# Altium project PCB_Project.PrjPcb
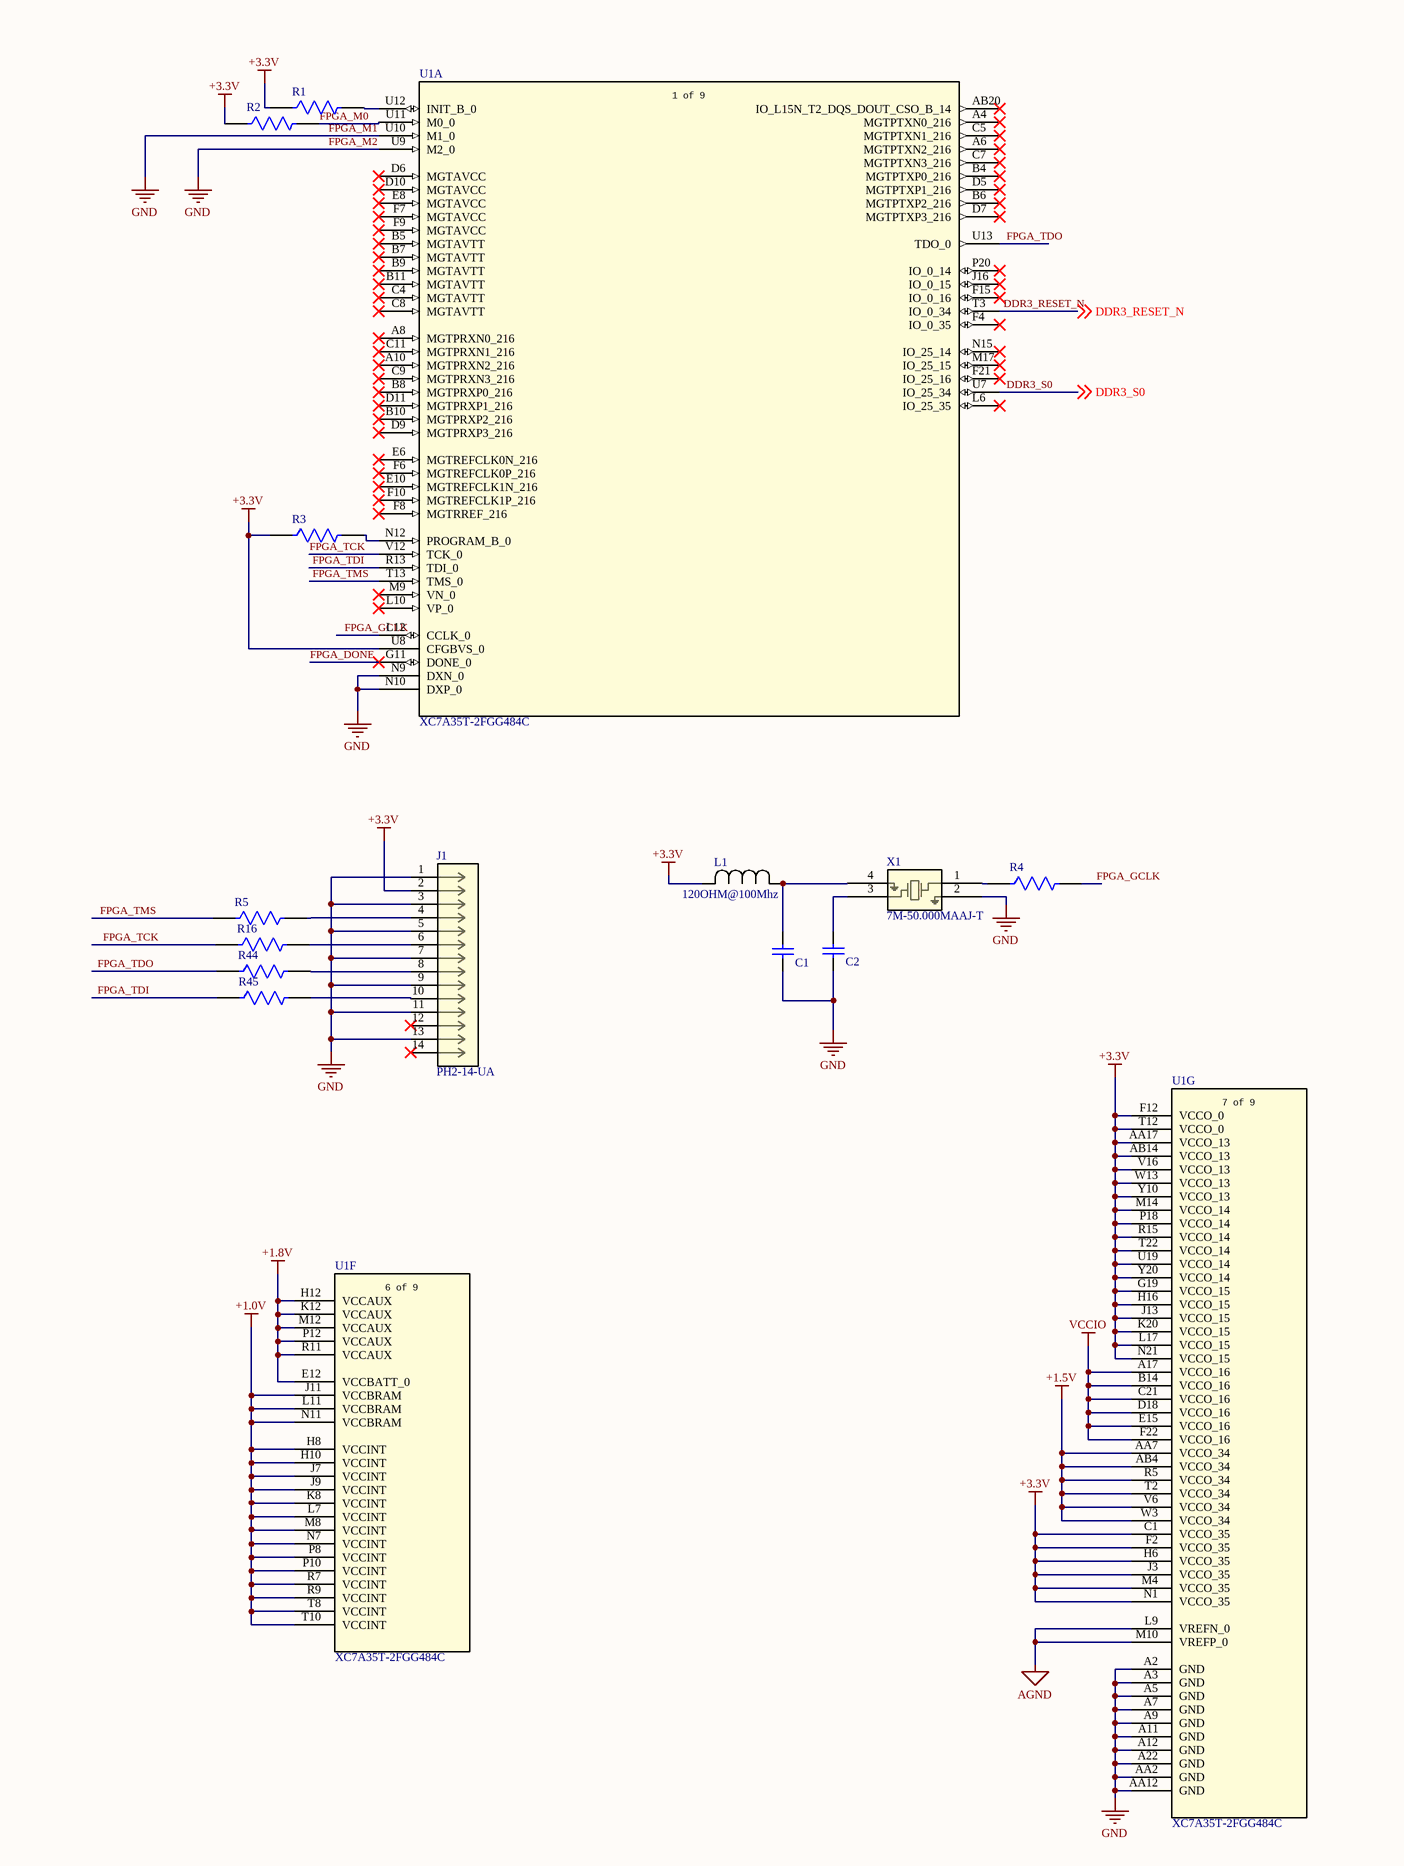
[diagram p0: Programming_and_Clock_FPGA.SchDoc, top left]
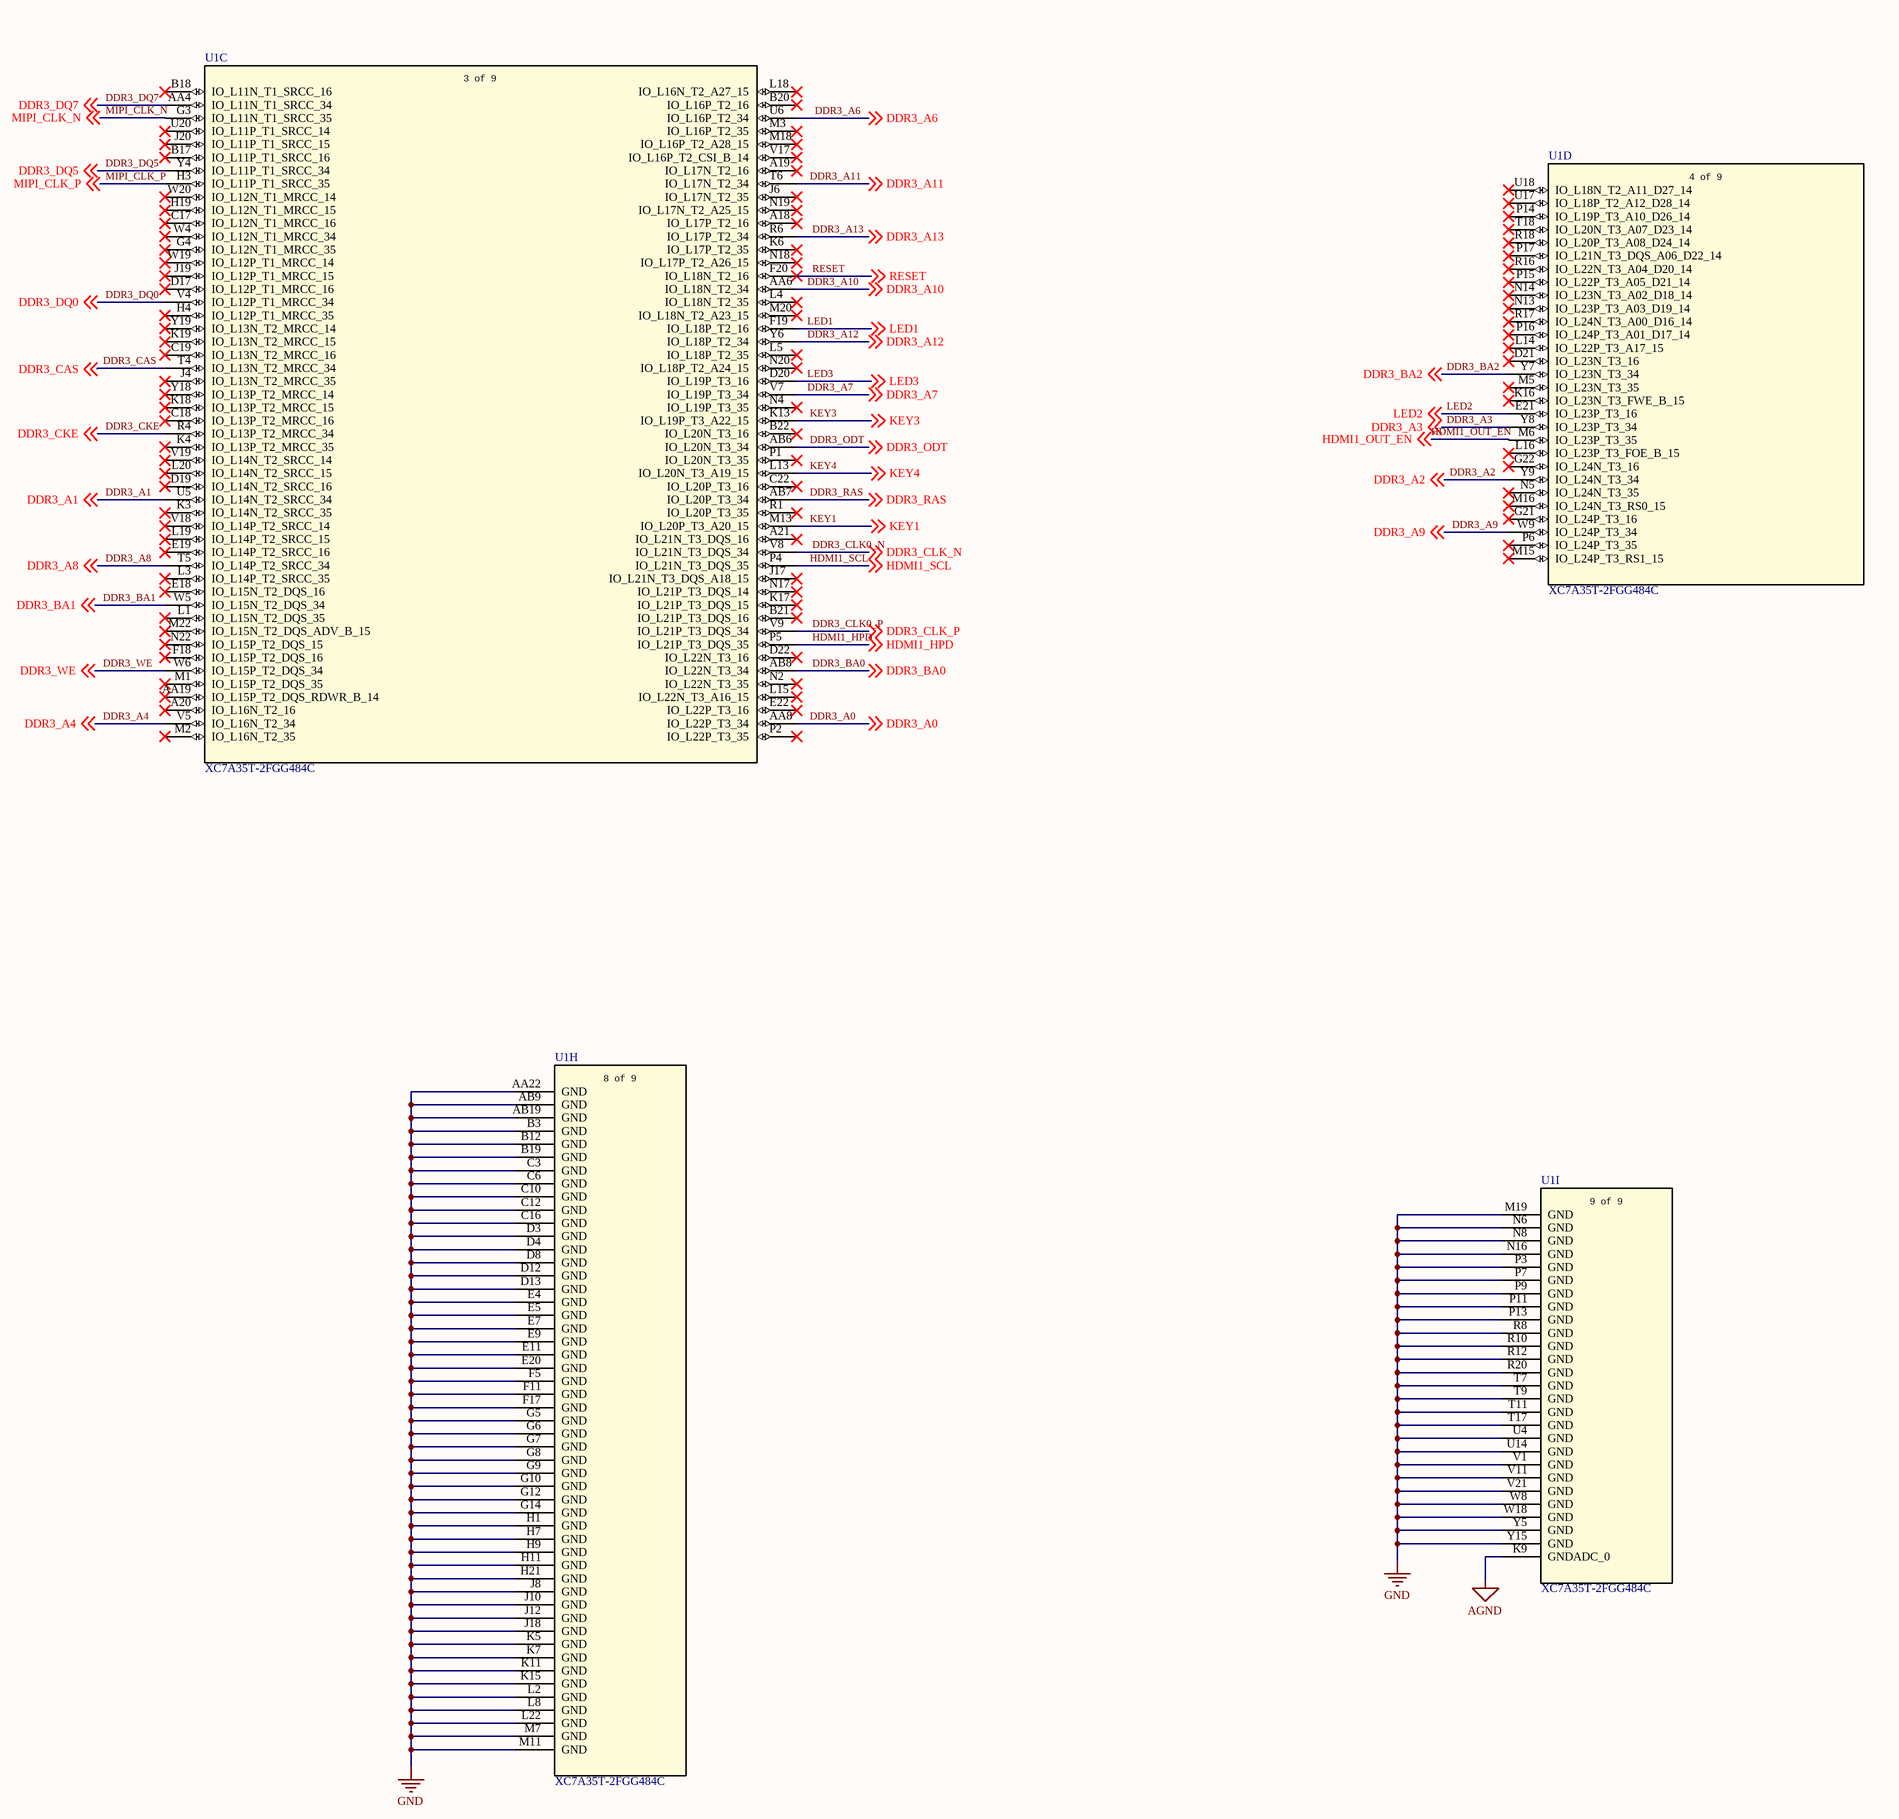
[diagram p1: Programming_and_Clock_FPGA.SchDoc, top right]
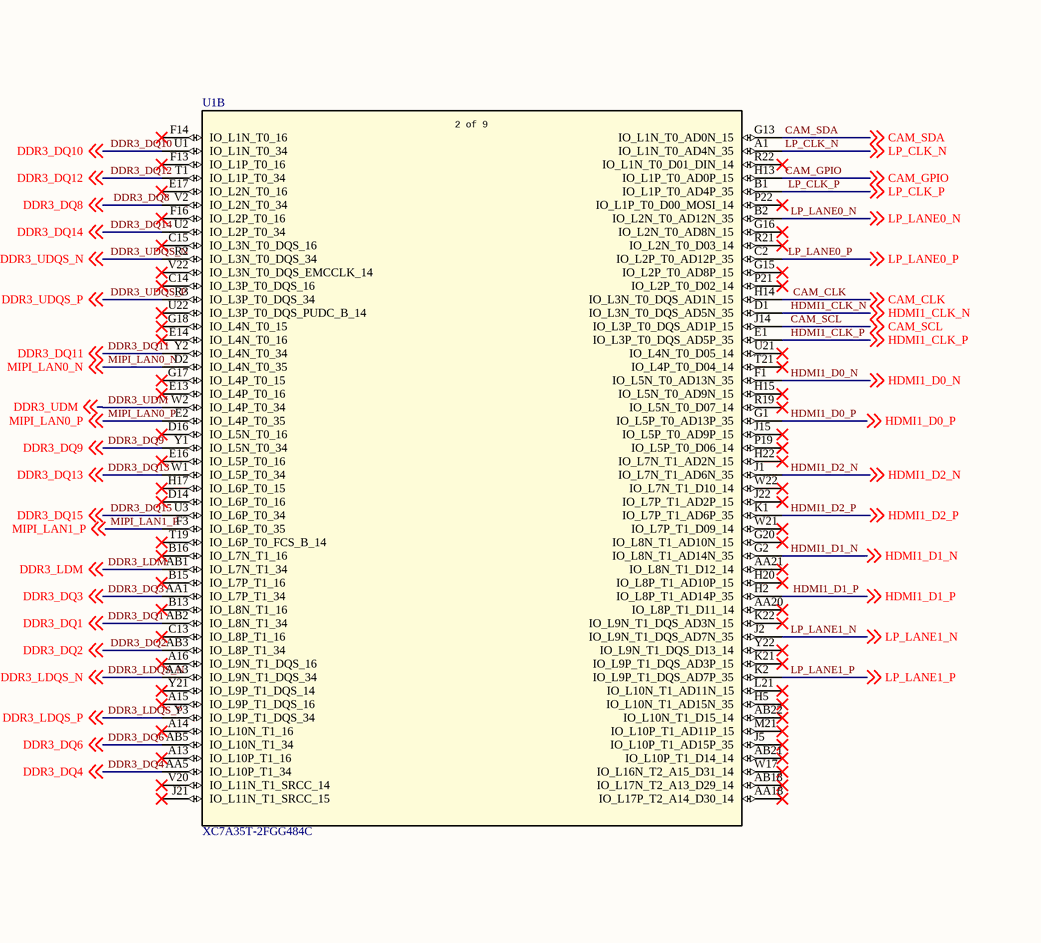
[diagram p2: Programming_and_Clock_FPGA.SchDoc, bottom left]
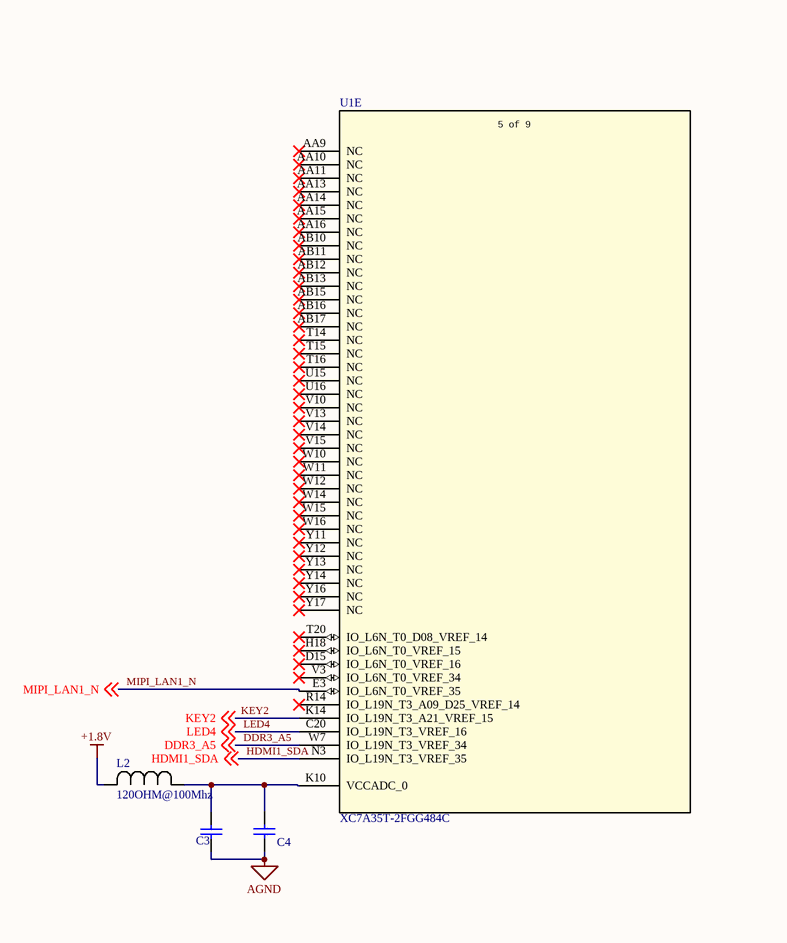
[diagram p3: Programming_and_Clock_FPGA.SchDoc, bottom right]
6 sheets, 170 parts. Net scope: global (net labels, ports and power ports of the same name join across sheets).
Board file: PCB1.PcbDoc
Sheets:
  Programming_and_Clock_FPGA.SchDoc
  RAM.SchDoc
  MIPI_Interface.SchDoc
  LEDS_And_Buttons.SchDoc
  HDMI.SchDoc
  Power_supply.SchDoc

## Sheet Programming_and_Clock_FPGA.SchDoc
size A1; SheetNumber: 1; SheetTotal: 6

### Parts
C1  VJ0805Y152KXAAC  [CAPC2013X145X48NL20T23]  (value not drawn)
C2  VJ0805Y152KXAAC  [CAPC2013X145X48NL20T23]  (value not drawn)
C3  VJ0805Y152KXAAC  [CAPC2013X145X48NL20T23]  (value not drawn)
C4  VJ0805Y152KXAAC  [CAPC2013X145X48NL20T23]  (value not drawn)
J1  PH2-14-UA  [CONN_PH2-14-UA_ADM]
L1  120OHM@100Mhz  [IND_0603_TDK]
L2  120OHM@100Mhz  [IND_0603_TDK]
R1  MCU0805MD4991BP100  [FP-MCU0805-MFG]  (value not drawn)
R2  MCU0805MD4991BP100  [FP-MCU0805-MFG]  (value not drawn)
R3  MCU0805MD4991BP100  [FP-MCU0805-MFG]  (value not drawn)
R4  MCU0805MD4991BP100  [FP-MCU0805-MFG]  (value not drawn)
R5  MCU0805MD4991BP100  [FP-MCU0805-MFG]  (value not drawn)
R16  MCU0805MD4991BP100  [FP-MCU0805-MFG]  (value not drawn)
R44  MCU0805MD4991BP100  [FP-MCU0805-MFG]  (value not drawn)
R45  MCU0805MD4991BP100  [FP-MCU0805-MFG]  (value not drawn)
U1  XC7A35T-2FGG484C  [FGG484_AMD]  (parts A,B,C,D,E,F,G,H,I of 9)
X1  7M-50.000MAAJ-T  [7M_TXC]

### Nets
+1.0V: U1.H8(VCCINT) U1.H10(VCCINT) U1.J7(VCCINT) U1.J9(VCCINT) U1.J11(VCCBRAM) U1.K8(VCCINT) U1.L7(VCCINT) U1.L11(VCCBRAM) U1.M8(VCCINT) U1.N7(VCCINT) U1.N11(VCCBRAM) U1.P8(VCCINT) U1.P10(VCCINT) U1.R7(VCCINT) U1.R9(VCCINT) U1.T8(VCCINT) U1.T10(VCCINT)
+1.5V: U1.AA7(VCCO_34) U1.AB4(VCCO_34) U1.R5(VCCO_34) U1.T2(VCCO_34) U1.V6(VCCO_34) U1.W3(VCCO_34)
+1.8V: L2.2 U1.E12(VCCBATT_0) U1.H12(VCCAUX) U1.K12(VCCAUX) U1.M12(VCCAUX) U1.P12(VCCAUX) U1.R11(VCCAUX)
+3.3V: J1.2 L1.2 R1.1 R2.1 R3.1 U1.AA17(VCCO_13) U1.AB14(VCCO_13) U1.C1(VCCO_35) U1.F2(VCCO_35) U1.F12(VCCO_0) U1.H6(VCCO_35) U1.J3(VCCO_35) U1.M4(VCCO_35) U1.N1(VCCO_35) U1.T12(VCCO_0) U1.U8(CFGBVS_0) U1.V16(VCCO_13)
AGND: C3.1 C4.1 U1.K9(GNDADC_0) U1.L9(VREFN_0) U1.M10(VREFP_0)
FPGA_M1: C1.1 C2.2 J1.1 J1.3 J1.5 J1.7 J1.9 J1.11 J1.13 U1.A2(GND) U1.A3(GND) U1.A5(GND) U1.A7(GND) U1.A9(GND) U1.A11(GND) U1.A12(GND) U1.A22(GND) U1.AA2(GND) U1.AA12(GND) U1.AA22(GND) U1.AB9(GND) U1.AB19(GND) U1.B3(GND) U1.B12(GND) U1.B19(GND) U1.C3(GND) U1.C6(GND) U1.C10(GND) U1.C12(GND) U1.C16(GND) U1.D3(GND) U1.D4(GND) U1.D8(GND) U1.D12(GND) U1.D13(GND) U1.E4(GND) U1.E5(GND) U1.E7(GND) U1.E9(GND) U1.E11(GND) U1.E20(GND) U1.F5(GND) U1.F11(GND) U1.F17(GND) U1.G5(GND) U1.G6(GND) U1.G7(GND) U1.G8(GND) U1.G9(GND) U1.G10(GND) U1.G12(GND) U1.G14(GND) U1.H1(GND) U1.H7(GND) U1.H9(GND) U1.H11(GND) U1.H21(GND) U1.J8(GND) U1.J10(GND) U1.J12(GND) U1.J18(GND) U1.K5(GND) U1.K7(GND) U1.K11(GND) U1.K15(GND) U1.L2(GND) U1.L8(GND) U1.L22(GND) U1.M7(GND) U1.M11(GND) U1.M19(GND) U1.N6(GND) U1.N8(GND) U1.N9(DXN_0) U1.N10(DXP_0) U1.N16(GND) U1.P3(GND) U1.P7(GND) U1.P9(GND) U1.P11(GND) U1.P13(GND) U1.R8(GND) U1.R10(GND) U1.R12(GND) U1.R20(GND) U1.T7(GND) U1.T9(GND) U1.T11(GND) U1.T17(GND) U1.U4(GND) U1.U9(M2_0) U1.U10(M1_0) U1.U14(GND) U1.V1(GND) U1.V11(GND) U1.V21(GND) U1.W8(GND) U1.W18(GND) U1.Y5(GND) U1.Y15(GND) X1.2  [also labelled FPGA_M2, GND]
VCCIO: U1.A17(VCCO_16) U1.B14(VCCO_16) U1.C21(VCCO_16) U1.D18(VCCO_16) U1.E15(VCCO_16) U1.F22(VCCO_16)
CAM_CLK: U1.H14(IO_L3N_T0_DQS_AD1N_15) ; off-sheet CAM_CLK
CAM_GPIO: U1.H13(IO_L1P_T0_AD0P_15) ; off-sheet CAM_GPIO
CAM_SCL: U1.J14(IO_L3P_T0_DQS_AD1P_15) ; off-sheet CAM_SCL
CAM_SDA: U1.G13(IO_L1N_T0_AD0N_15) ; off-sheet CAM_SDA
DDR3_A0: U1.AA8(IO_L22P_T3_34) ; off-sheet DDR3_A0
DDR3_A1: U1.U5(IO_L14N_T2_SRCC_34) ; off-sheet DDR3_A1
DDR3_A2: U1.Y9(IO_L24N_T3_34) ; off-sheet DDR3_A2
DDR3_A3: U1.Y8(IO_L23P_T3_34) ; off-sheet DDR3_A3
DDR3_A4: U1.V5(IO_L16N_T2_34) ; off-sheet DDR3_A4
DDR3_A5: U1.W7(IO_L19N_T3_VREF_34) ; off-sheet DDR3_A5
DDR3_A6: U1.U6(IO_L16P_T2_34) ; off-sheet DDR3_A6
DDR3_A7: U1.V7(IO_L19P_T3_34) ; off-sheet DDR3_A7
DDR3_A8: U1.T5(IO_L14P_T2_SRCC_34) ; off-sheet DDR3_A8
DDR3_A9: U1.W9(IO_L24P_T3_34) ; off-sheet DDR3_A9
DDR3_A10: U1.AA6(IO_L18N_T2_34) ; off-sheet DDR3_A10
DDR3_A11: U1.T6(IO_L17N_T2_34) ; off-sheet DDR3_A11
DDR3_A12: U1.Y6(IO_L18P_T2_34) ; off-sheet DDR3_A12
DDR3_A13: U1.R6(IO_L17P_T2_34) ; off-sheet DDR3_A13
DDR3_BA0: U1.AB8(IO_L22N_T3_34) ; off-sheet DDR3_BA0
DDR3_BA1: U1.W5(IO_L15N_T2_DQS_34) ; off-sheet DDR3_BA1
DDR3_BA2: U1.Y7(IO_L23N_T3_34) ; off-sheet DDR3_BA2
DDR3_CAS: U1.T4(IO_L13N_T2_MRCC_34) ; off-sheet DDR3_CAS
DDR3_CKE: U1.R4(IO_L13P_T2_MRCC_34) ; off-sheet DDR3_CKE
DDR3_CLK0_N: U1.V8(IO_L21N_T3_DQS_34) ; off-sheet DDR3_CLK_N  [also labelled DDR3_CLK_N]
DDR3_CLK0_P: U1.V9(IO_L21P_T3_DQS_34) ; off-sheet DDR3_CLK_P  [also labelled DDR3_CLK_P]
DDR3_DQ0: U1.V4(IO_L12P_T1_MRCC_34) ; off-sheet DDR3_DQ0
DDR3_DQ1: U1.AB2(IO_L8N_T1_34) ; off-sheet DDR3_DQ1
DDR3_DQ2: U1.AB3(IO_L8P_T1_34) ; off-sheet DDR3_DQ2
DDR3_DQ3: U1.AA1(IO_L7P_T1_34) ; off-sheet DDR3_DQ3
DDR3_DQ4: U1.AA5(IO_L10P_T1_34) ; off-sheet DDR3_DQ4
DDR3_DQ5: U1.Y4(IO_L11P_T1_SRCC_34) ; off-sheet DDR3_DQ5
DDR3_DQ6: U1.AB5(IO_L10N_T1_34) ; off-sheet DDR3_DQ6
DDR3_DQ7: U1.AA4(IO_L11N_T1_SRCC_34) ; off-sheet DDR3_DQ7
DDR3_DQ8: U1.V2(IO_L2N_T0_34) ; off-sheet DDR3_DQ8
DDR3_DQ9: U1.Y1(IO_L5N_T0_34) ; off-sheet DDR3_DQ9
DDR3_DQ10: U1.U1(IO_L1N_T0_34) ; off-sheet DDR3_DQ10
DDR3_DQ11: U1.Y2(IO_L4N_T0_34) ; off-sheet DDR3_DQ11
DDR3_DQ12: U1.T1(IO_L1P_T0_34) ; off-sheet DDR3_DQ12
DDR3_DQ13: U1.W1(IO_L5P_T0_34) ; off-sheet DDR3_DQ13
DDR3_DQ14: U1.U2(IO_L2P_T0_34) ; off-sheet DDR3_DQ14
DDR3_DQ15: U1.U3(IO_L6P_T0_34) ; off-sheet DDR3_DQ15
DDR3_LDM: U1.AB1(IO_L7N_T1_34) ; off-sheet DDR3_LDM
DDR3_LDQS_N: U1.AA3(IO_L9N_T1_DQS_34) ; off-sheet DDR3_LDQS_N
DDR3_LDQS_P: U1.Y3(IO_L9P_T1_DQS_34) ; off-sheet DDR3_LDQS_P
DDR3_ODT: U1.AB6(IO_L20N_T3_34) ; off-sheet DDR3_ODT
DDR3_RAS: U1.AB7(IO_L20P_T3_34) ; off-sheet DDR3_RAS
DDR3_RESET_N: U1.T3(IO_0_34) ; off-sheet DDR3_RESET_N
DDR3_S0: U1.U7(IO_25_34) ; off-sheet DDR3_S0
DDR3_UDM: U1.W2(IO_L4P_T0_34) ; off-sheet DDR3_UDM
DDR3_UDQS_N: U1.R2(IO_L3N_T0_DQS_34) ; off-sheet DDR3_UDQS_N
DDR3_UDQS_P: U1.R3(IO_L3P_T0_DQS_34) ; off-sheet DDR3_UDQS_P
DDR3_WE: U1.W6(IO_L15P_T2_DQS_34) ; off-sheet DDR3_WE
FPGA_DONE: U1.G11(DONE_0)
FPGA_GCLK: R4.2 U1.L12(CCLK_0)
FPGA_M0: R2.2 U1.U11(M0_0)
FPGA_TCK: R16.1 U1.V12(TCK_0)
FPGA_TDI: R45.1 U1.R13(TDI_0)
FPGA_TDO: R44.1 U1.U13(TDO_0)
FPGA_TMS: R5.1 U1.T13(TMS_0)
HDMI1_CLK_N: U1.D1(IO_L3N_T0_DQS_AD5N_35) ; off-sheet HDMI1_CLK_N
HDMI1_CLK_P: U1.E1(IO_L3P_T0_DQS_AD5P_35) ; off-sheet HDMI1_CLK_P
HDMI1_D0_N: U1.F1(IO_L5N_T0_AD13N_35) ; off-sheet HDMI1_D0_N
HDMI1_D0_P: U1.G1(IO_L5P_T0_AD13P_35) ; off-sheet HDMI1_D0_P
HDMI1_D1_N: U1.G2(IO_L8N_T1_AD14N_35) ; off-sheet HDMI1_D1_N
HDMI1_D1_P: U1.H2(IO_L8P_T1_AD14P_35) ; off-sheet HDMI1_D1_P
HDMI1_D2_N: U1.J1(IO_L7N_T1_AD6N_35) ; off-sheet HDMI1_D2_N
HDMI1_D2_P: U1.K1(IO_L7P_T1_AD6P_35) ; off-sheet HDMI1_D2_P
HDMI1_HPD: U1.P5(IO_L21P_T3_DQS_35) ; off-sheet HDMI1_HPD
HDMI1_OUT_EN: U1.M6(IO_L23P_T3_35) ; off-sheet HDMI1_OUT_EN
HDMI1_SCL: U1.P4(IO_L21N_T3_DQS_35) ; off-sheet HDMI1_SCL
HDMI1_SDA: U1.N3(IO_L19N_T3_VREF_35) ; off-sheet HDMI1_SDA
KEY1: U1.M13(IO_L20P_T3_A20_15) ; off-sheet KEY1
KEY2: U1.K14(IO_L19N_T3_A21_VREF_15) ; off-sheet KEY2
KEY3: U1.K13(IO_L19P_T3_A22_15) ; off-sheet KEY3
KEY4: U1.L13(IO_L20N_T3_A19_15) ; off-sheet KEY4
LED1: U1.F19(IO_L18P_T2_16) ; off-sheet LED1
LED2: U1.E21(IO_L23P_T3_16) ; off-sheet LED2
LED3: U1.D20(IO_L19P_T3_16) ; off-sheet LED3
LED4: U1.C20(IO_L19N_T3_VREF_16) ; off-sheet LED4
LP_CLK_N: U1.A1(IO_L1N_T0_AD4N_35) ; off-sheet LP_CLK_N
LP_CLK_P: U1.B1(IO_L1P_T0_AD4P_35) ; off-sheet LP_CLK_P
LP_LANE0_N: U1.B2(IO_L2N_T0_AD12N_35) ; off-sheet LP_LANE0_N
LP_LANE0_P: U1.C2(IO_L2P_T0_AD12P_35) ; off-sheet LP_LANE0_P
LP_LANE1_N: U1.J2(IO_L9N_T1_DQS_AD7N_35) ; off-sheet LP_LANE1_N
LP_LANE1_P: U1.K2(IO_L9P_T1_DQS_AD7P_35) ; off-sheet LP_LANE1_P
MIPI_CLK_N: U1.G3(IO_L11N_T1_SRCC_35) ; off-sheet MIPI_CLK_N
MIPI_CLK_P: U1.H3(IO_L11P_T1_SRCC_35) ; off-sheet MIPI_CLK_P
MIPI_LAN0_N: U1.D2(IO_L4N_T0_35) ; off-sheet MIPI_LAN0_N
MIPI_LAN0_P: U1.E2(IO_L4P_T0_35) ; off-sheet MIPI_LAN0_P
MIPI_LAN1_N: U1.E3(IO_L6N_T0_VREF_35) ; off-sheet MIPI_LAN1_N
MIPI_LAN1_P: U1.F3(IO_L6P_T0_35) ; off-sheet MIPI_LAN1_P
RESET: U1.F20(IO_L18N_T2_16) ; off-sheet RESET
NetC1_2: C1.2 L1.1 X1.4
NetC2_1: C2.1 X1.3
NetC3_2: C3.2 C4.2 L2.1 U1.K10(VCCADC_0)
NetJ1_4: J1.4 R5.2
NetJ1_6: J1.6 R16.2
NetJ1_8: J1.8 R44.2
NetJ1_10: J1.10 R45.2
NetR1_2: R1.2 U1.U12(INIT_B_0)
NetR3_2: R3.2 U1.N12(PROGRAM_B_0)
NetR4_1: R4.1 X1.1
NetU1_G19: U1.G19(VCCO_15) U1.H16(VCCO_15) U1.J13(VCCO_15) U1.K20(VCCO_15) U1.L17(VCCO_15) U1.M14(VCCO_14) U1.N21(VCCO_15) U1.P18(VCCO_14) U1.R15(VCCO_14) U1.T22(VCCO_14) U1.U19(VCCO_14) U1.W13(VCCO_13) U1.Y10(VCCO_13) U1.Y20(VCCO_14)

Not connected (* = marked no-connect by the designer): J1 12* 14*; U1 A4(MGTPTXN0_216)* A6(MGTPTXN2_216)* A8(MGTPRXN0_216)* A10(MGTPRXN2_216)* A13(IO_L10P_T1_16)* A14(IO_L10N_T1_16)* A15(IO_L9P_T1_DQS_16)* A16(IO_L9N_T1_DQS_16)* A18(IO_L17P_T2_16)* A19(IO_L17N_T2_16)* A20(IO_L16N_T2_16)* A21(IO_L21N_T3_DQS_16)* AA9(NC)* AA10(NC)* AA11(NC)* AA13(NC)* AA14(NC)* AA15(NC)* AA16(NC)* AA18(IO_L17P_T2_A14_D30_14)* AA19(IO_L15P_T2_DQS_RDWR_B_14)* AA20(IO_L8P_T1_D11_14)* AA21(IO_L8N_T1_D12_14)* AB10(NC)* AB11(NC)* AB12(NC)* AB13(NC)* AB15(NC)* AB16(NC)* AB17(NC)* AB18(IO_L17N_T2_A13_D29_14)* AB20(IO_L15N_T2_DQS_DOUT_CSO_B_14)* AB21(IO_L10P_T1_D14_14)* AB22(IO_L10N_T1_D15_14)* B4(MGTPTXP0_216)* B5(MGTAVTT)* B6(MGTPTXP2_216)* B7(MGTAVTT)* B8(MGTPRXP0_216)* B9(MGTAVTT)* B10(MGTPRXP2_216)* B11(MGTAVTT)* B13(IO_L8N_T1_16)* B15(IO_L7P_T1_16)* B16(IO_L7N_T1_16)* B17(IO_L11P_T1_SRCC_16)* B18(IO_L11N_T1_SRCC_16)* B20(IO_L16P_T2_16)* B21(IO_L21P_T3_DQS_16)* B22(IO_L20N_T3_16)* C4(MGTAVTT)* C5(MGTPTXN1_216)* C7(MGTPTXN3_216)* C8(MGTAVTT)* C9(MGTPRXN3_216)* C11(MGTPRXN1_216)* C13(IO_L8P_T1_16)* C14(IO_L3P_T0_DQS_16)* C15(IO_L3N_T0_DQS_16)* C17(IO_L12N_T1_MRCC_16)* C18(IO_L13P_T2_MRCC_16)* C19(IO_L13N_T2_MRCC_16)* C22(IO_L20P_T3_16)* D5(MGTPTXP1_216)* D6(MGTAVCC)* D7(MGTPTXP3_216)* D9(MGTPRXP3_216)* D10(MGTAVCC)* D11(MGTPRXP1_216)* D14(IO_L6P_T0_16)* D15(IO_L6N_T0_VREF_16)* D16(IO_L5N_T0_16)* D17(IO_L12P_T1_MRCC_16)* D19(IO_L14N_T2_SRCC_16)* D21(IO_L23N_T3_16)* D22(IO_L22N_T3_16)* E6(MGTREFCLK0N_216)* E8(MGTAVCC)* E10(MGTREFCLK1N_216)* E13(IO_L4P_T0_16)* E14(IO_L4N_T0_16)* E16(IO_L5P_T0_16)* E17(IO_L2N_T0_16)* E18(IO_L15N_T2_DQS_16)* E19(IO_L14P_T2_SRCC_16)* E22(IO_L22P_T3_16)* F4(IO_0_35)* F6(MGTREFCLK0P_216)* F7(MGTAVCC)* F8(MGTRREF_216)* F9(MGTAVCC)* F10(MGTREFCLK1P_216)* F13(IO_L1P_T0_16)* F14(IO_L1N_T0_16)* F15(IO_0_16)* F16(IO_L2P_T0_16)* F18(IO_L15P_T2_DQS_16)* F21(IO_25_16)* G4(IO_L12N_T1_MRCC_35)* G15(IO_L2P_T0_AD8P_15)* G16(IO_L2N_T0_AD8N_15)* G17(IO_L4P_T0_15)* G18(IO_L4N_T0_15)* G20(IO_L8N_T1_AD10N_15)* G21(IO_L24P_T3_16)* G22(IO_L24N_T3_16)* H4(IO_L12P_T1_MRCC_35)* H5(IO_L10N_T1_AD15N_35)* H15(IO_L5N_T0_AD9N_15)* H17(IO_L6P_T0_15)* H18(IO_L6N_T0_VREF_15)* H19(IO_L12N_T1_MRCC_15)* H20(IO_L8P_T1_AD10P_15)* H22(IO_L7N_T1_AD2N_15)* J4(IO_L13N_T2_MRCC_35)* J5(IO_L10P_T1_AD15P_35)* J6(IO_L17N_T2_35)* J15(IO_L5P_T0_AD9P_15)* J16(IO_0_15)* J17(IO_L21N_T3_DQS_A18_15)* J19(IO_L12P_T1_MRCC_15)* J20(IO_L11P_T1_SRCC_15)* J21(IO_L11N_T1_SRCC_15)* J22(IO_L7P_T1_AD2P_15)* K3(IO_L14N_T2_SRCC_35)* K4(IO_L13P_T2_MRCC_35)* K6(IO_L17P_T2_35)* K16(IO_L23N_T3_FWE_B_15)* K17(IO_L21P_T3_DQS_15)* K18(IO_L13P_T2_MRCC_15)* K19(IO_L13N_T2_MRCC_15)* K21(IO_L9P_T1_DQS_AD3P_15)* K22(IO_L9N_T1_DQS_AD3N_15)* L1(IO_L15N_T2_DQS_35)* L3(IO_L14P_T2_SRCC_35)* L4(IO_L18N_T2_35)* L5(IO_L18P_T2_35)* L6(IO_25_35)* L10(VP_0)* L14(IO_L22P_T3_A17_15)* L15(IO_L22N_T3_A16_15)* L16(IO_L23P_T3_FOE_B_15)* L18(IO_L16N_T2_A27_15)* L19(IO_L14P_T2_SRCC_15)* L20(IO_L14N_T2_SRCC_15)* L21(IO_L10N_T1_AD11N_15)* M1(IO_L15P_T2_DQS_35)* M2(IO_L16N_T2_35)* M3(IO_L16P_T2_35)* M5(IO_L23N_T3_35)* M9(VN_0)* M15(IO_L24P_T3_RS1_15)* M16(IO_L24N_T3_RS0_15)* M17(IO_25_15)* M18(IO_L16P_T2_A28_15)* M20(IO_L18N_T2_A23_15)* M21(IO_L10P_T1_AD11P_15)* M22(IO_L15N_T2_DQS_ADV_B_15)* N2(IO_L22N_T3_35)* N4(IO_L19P_T3_35)* N5(IO_L24N_T3_35)* N13(IO_L23P_T3_A03_D19_14)* N14(IO_L23N_T3_A02_D18_14)* N15(IO_25_14)* N17(IO_L21P_T3_DQS_14)* N18(IO_L17P_T2_A26_15)* N19(IO_L17N_T2_A25_15)* N20(IO_L18P_T2_A24_15)* N22(IO_L15P_T2_DQS_15)* P1(IO_L20N_T3_35)* P2(IO_L22P_T3_35)* P6(IO_L24P_T3_35)* P14(IO_L19P_T3_A10_D26_14)* P15(IO_L22P_T3_A05_D21_14)* P16(IO_L24P_T3_A01_D17_14)* P17(IO_L21N_T3_DQS_A06_D22_14)* P19(IO_L5P_T0_D06_14)* P20(IO_0_14)* P21(IO_L2P_T0_D02_14)* P22(IO_L1P_T0_D00_MOSI_14)* R1(IO_L20P_T3_35)* R14(IO_L19N_T3_A09_D25_VREF_14)* R16(IO_L22N_T3_A04_D20_14)* R17(IO_L24N_T3_A00_D16_14)* R18(IO_L20P_T3_A08_D24_14)* R19(IO_L5N_T0_D07_14)* R21(IO_L2N_T0_D03_14)* R22(IO_L1N_T0_D01_DIN_14)* T14(NC)* T15(NC)* T16(NC)* T18(IO_L20N_T3_A07_D23_14)* T19(IO_L6P_T0_FCS_B_14)* T20(IO_L6N_T0_D08_VREF_14)* T21(IO_L4P_T0_D04_14)* U15(NC)* U16(NC)* U17(IO_L18P_T2_A12_D28_14)* U18(IO_L18N_T2_A11_D27_14)* U20(IO_L11P_T1_SRCC_14)* U21(IO_L4N_T0_D05_14)* U22(IO_L3P_T0_DQS_PUDC_B_14)* V3(IO_L6N_T0_VREF_34)* V10(NC)* V13(NC)* V14(NC)* V15(NC)* V17(IO_L16P_T2_CSI_B_14)* V18(IO_L14P_T2_SRCC_14)* V19(IO_L14N_T2_SRCC_14)* V20(IO_L11N_T1_SRCC_14)* V22(IO_L3N_T0_DQS_EMCCLK_14)* W4(IO_L12N_T1_MRCC_34)* W10(NC)* W11(NC)* W12(NC)* W14(NC)* W15(NC)* W16(NC)* W17(IO_L16N_T2_A15_D31_14)* W19(IO_L12P_T1_MRCC_14)* W20(IO_L12N_T1_MRCC_14)* W21(IO_L7P_T1_D09_14)* W22(IO_L7N_T1_D10_14)* Y11(NC)* Y12(NC)* Y13(NC)* Y14(NC)* Y16(NC)* Y17(NC)* Y18(IO_L13P_T2_MRCC_14)* Y19(IO_L13N_T2_MRCC_14)* Y21(IO_L9P_T1_DQS_14)* Y22(IO_L9N_T1_DQS_D13_14)*

### Notes on the sheet
- (in symbol XC7A35T-2FGG484C, part A) 1 of 9
- (in symbol XC7A35T-2FGG484C, part B) 2 of 9
- (in symbol XC7A35T-2FGG484C, part C) 3 of 9
- (in symbol XC7A35T-2FGG484C, part D) 4 of 9
- (in symbol XC7A35T-2FGG484C, part E) 5 of 9
- (in symbol XC7A35T-2FGG484C, part F) 6 of 9
- (in symbol XC7A35T-2FGG484C, part G) 7 of 9
- (in symbol XC7A35T-2FGG484C, part H) 8 of 9
- (in symbol XC7A35T-2FGG484C, part I) 9 of 9

### Library data of the parts
C1-C4 = CMP-2007-01729-1: Manufacturer: Vitramon; Part Number: VJ0805Y152KXAAC
J1 = PH2-14-UA: Description; Manufacturer_Name: ADAM TECHNOLOGIES INC; Type: Headers, Male Pins; Copyright: Copyright (C) 2025 Ultra Librarian. All rights reserved.; Manufacturer_Part_Number: PH2-14-UA; RefDes: RefDes
L1 L2 = MMZ0603Y121CT000: Description; Manufacturer_Name: TDK; Copyright: Copyright (C) 2026 Ultra Librarian. All rights reserved.; Manufacturer_Part_Number: MMZ0603Y121CT000
R1-R5 R16 R44 R45 = CMP-02407-000217-1: RES 1.05K OHM 0.5% 1/5W 0805; Resistance: 4.99kR; Power Rating: 200mW; Tolerance: 0.1%; Voltage Rating: 150V; Weight: 0.000194oz; Package Quantity: 1000; Height: 0.52mm; Case Code (Imperial): 0805; Width: 1.25mm; Packaging: Tape and Reel; Case/Package: 0805; Length: 2mm; Composition: Thin Film; Termination: SMD/SMT; Min Operating Temperature: -55°C; Case Code (Metric): 2012; Max Operating Temperature: 155°C
U1 = XC7A35T-2FGG484C: Description; Manufacturer_Name: AMD; Copyright: Copyright (C) 2026 Ultra Librarian. All rights reserved.; Manufacturer_Part_Number: XC7A35T-2FGG484C; RefDes: RefDes; Type: Type
X1 = 7M-50.000MAAJ-T: No Description Available; Manufacturer_Name: TXC; Copyright: Copyright (C) 2026 Ultra Librarian. All rights reserved.; Manufacturer_Part_Number: 7M-50.000MAAJ-T; RefDes: RefDes; Type: Type

## Sheet RAM.SchDoc
size A3; SheetNumber: 2; SheetTotal: 6
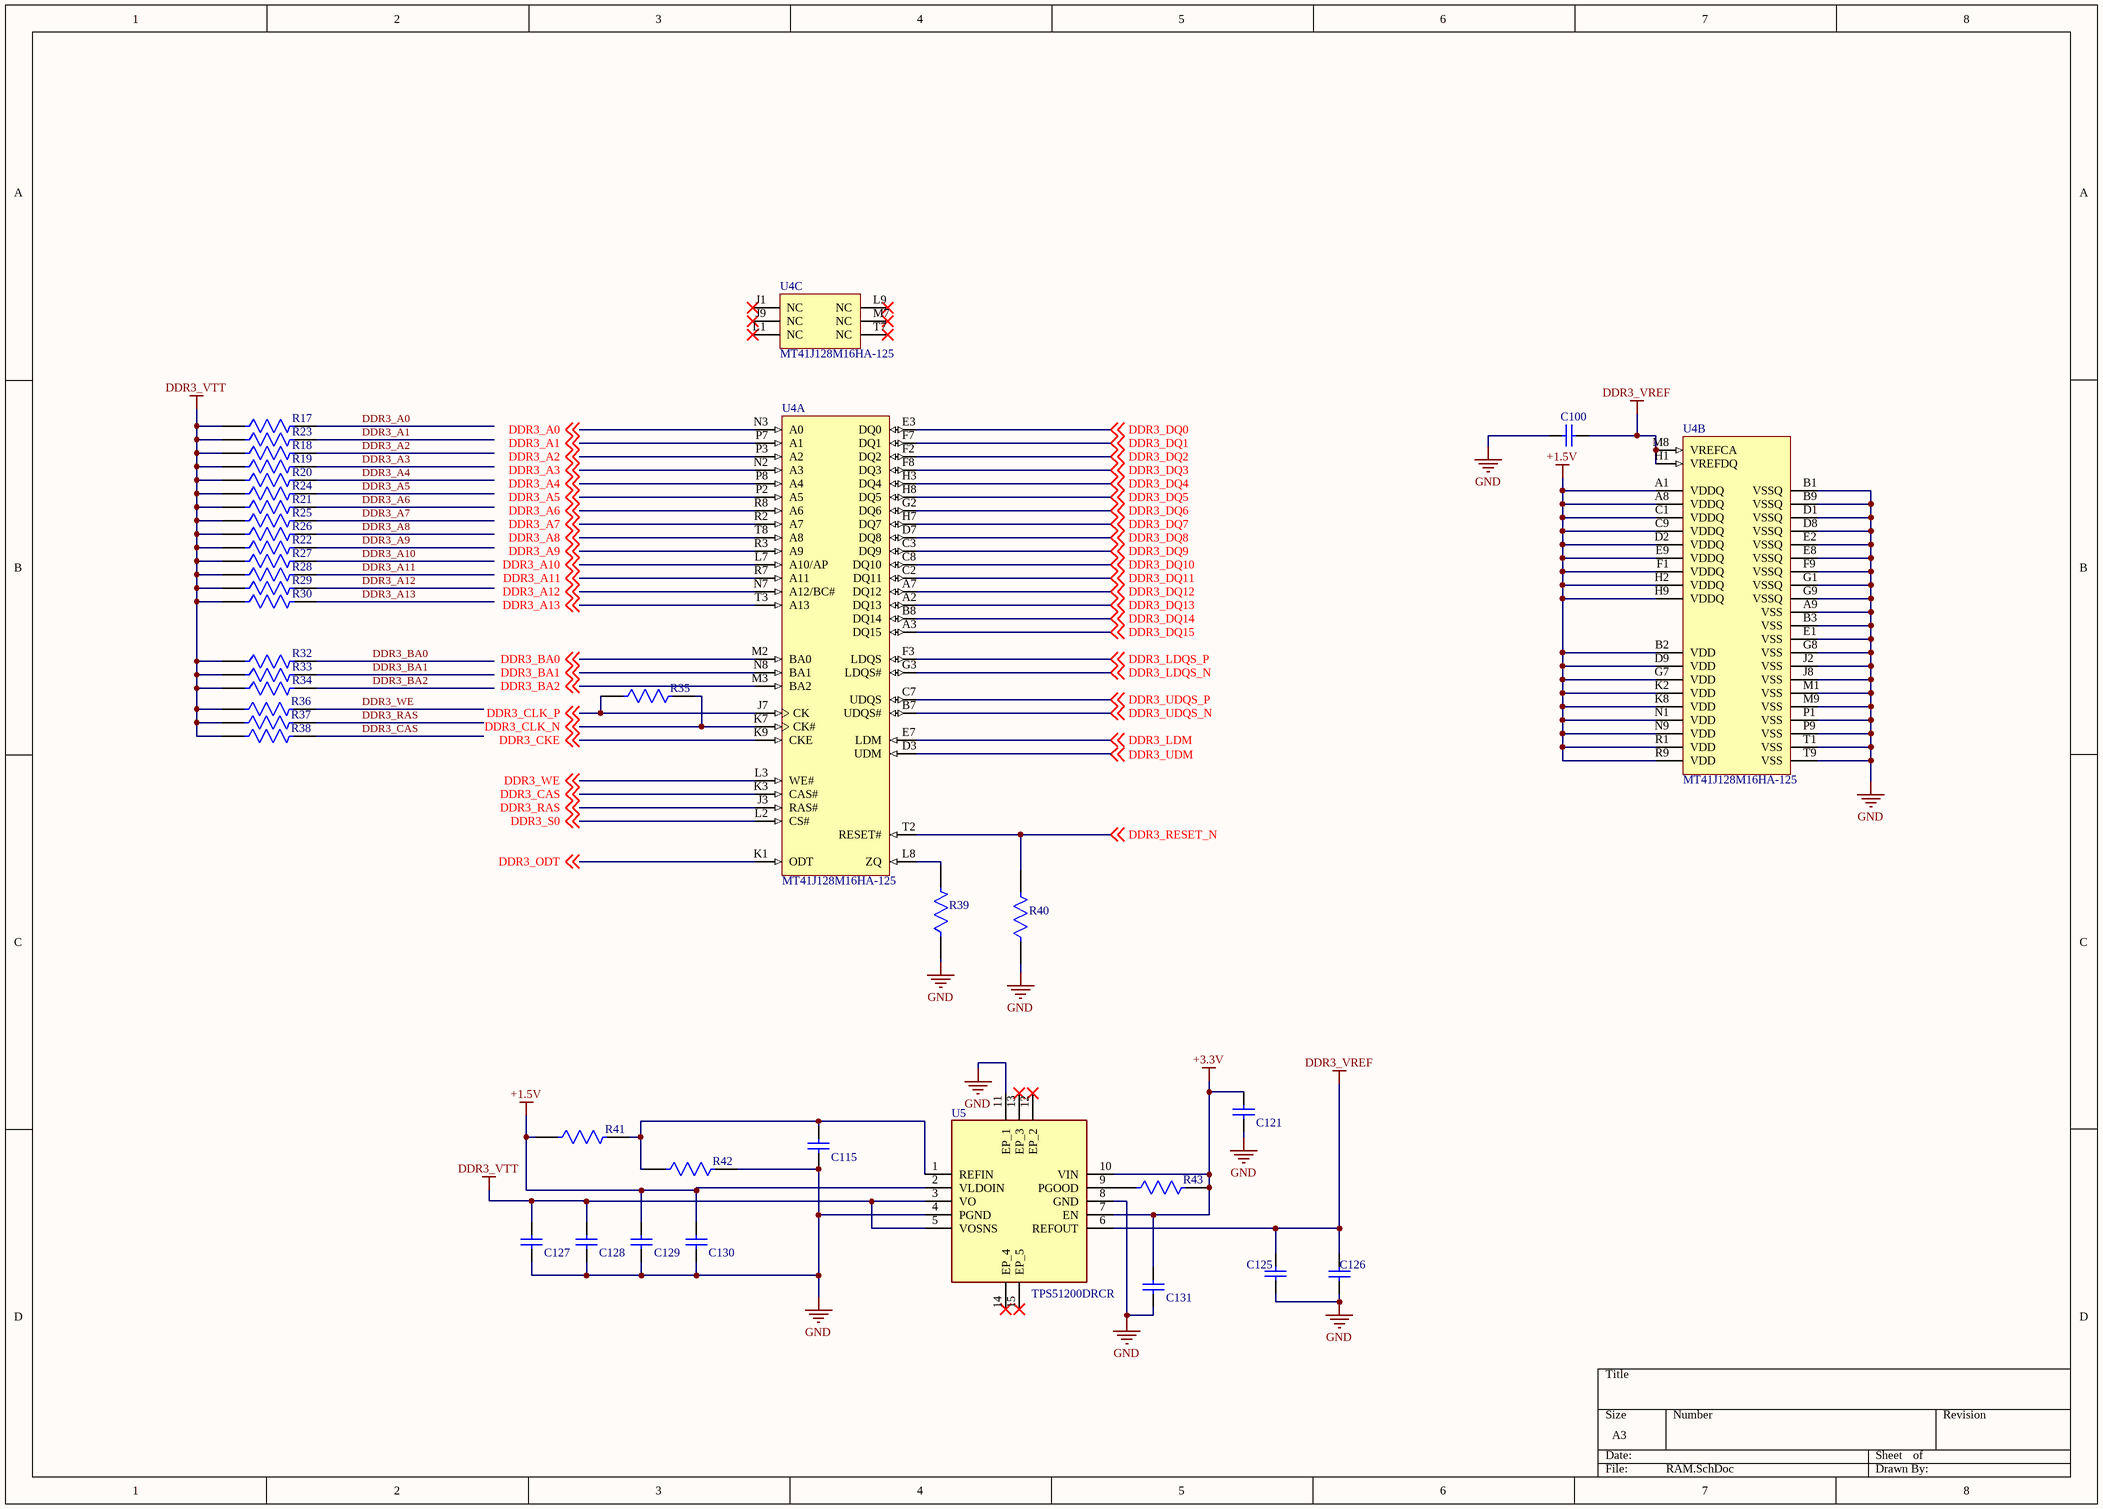
[diagram p4: RAM.SchDoc]

### Parts
C100  VJ0805Y152KXAAC  [CAPC2013X145X48NL20T23]  (value not drawn)
C115  VJ0805Y152KXAAC  [CAPC2013X145X48NL20T23]  (value not drawn)
C121  VJ0805Y152KXAAC  [CAPC2013X145X48NL20T23]  (value not drawn)
C125  VJ0805Y152KXAAC  [CAPC2013X145X48NL20T23]  (value not drawn)
C126  VJ0805Y152KXAAC  [CAPC2013X145X48NL20T23]  (value not drawn)
C127  VJ0805Y152KXAAC  [CAPC2013X145X48NL20T23]  (value not drawn)
C128  VJ0805Y152KXAAC  [CAPC2013X145X48NL20T23]  (value not drawn)
C129  VJ0805Y152KXAAC  [CAPC2013X145X48NL20T23]  (value not drawn)
C130  VJ0805Y152KXAAC  [CAPC2013X145X48NL20T23]  (value not drawn)
C131  VJ0805Y152KXAAC  [CAPC2013X145X48NL20T23]  (value not drawn)
R17  MCU0805MD4991BP100  [FP-MCU0805-MFG]  (value not drawn)
R18  MCU0805MD4991BP100  [FP-MCU0805-MFG]  (value not drawn)
R19  MCU0805MD4991BP100  [FP-MCU0805-MFG]  (value not drawn)
R20  MCU0805MD4991BP100  [FP-MCU0805-MFG]  (value not drawn)
R21  MCU0805MD4991BP100  [FP-MCU0805-MFG]  (value not drawn)
R22  MCU0805MD4991BP100  [FP-MCU0805-MFG]  (value not drawn)
R23  MCU0805MD4991BP100  [FP-MCU0805-MFG]  (value not drawn)
R24  MCU0805MD4991BP100  [FP-MCU0805-MFG]  (value not drawn)
R25  MCU0805MD4991BP100  [FP-MCU0805-MFG]  (value not drawn)
R26  MCU0805MD4991BP100  [FP-MCU0805-MFG]  (value not drawn)
R27  MCU0805MD4991BP100  [FP-MCU0805-MFG]  (value not drawn)
R28  MCU0805MD4991BP100  [FP-MCU0805-MFG]  (value not drawn)
R29  MCU0805MD4991BP100  [FP-MCU0805-MFG]  (value not drawn)
R30  MCU0805MD4991BP100  [FP-MCU0805-MFG]  (value not drawn)
R32  MCU0805MD4991BP100  [FP-MCU0805-MFG]  (value not drawn)
R33  MCU0805MD4991BP100  [FP-MCU0805-MFG]  (value not drawn)
R34  MCU0805MD4991BP100  [FP-MCU0805-MFG]  (value not drawn)
R35  MCU0805MD4991BP100  [FP-MCU0805-MFG]  (value not drawn)
R36  MCU0805MD4991BP100  [FP-MCU0805-MFG]  (value not drawn)
R37  MCU0805MD4991BP100  [FP-MCU0805-MFG]  (value not drawn)
R38  MCU0805MD4991BP100  [FP-MCU0805-MFG]  (value not drawn)
R39  MCU0805MD4991BP100  [FP-MCU0805-MFG]  (value not drawn)
R40  MCU0805MD4991BP100  [FP-MCU0805-MFG]  (value not drawn)
R41  MCU0805MD4991BP100  [FP-MCU0805-MFG]  (value not drawn)
R42  MCU0805MD4991BP100  [FP-MCU0805-MFG]  (value not drawn)
R43  MCU0805MD4991BP100  [FP-MCU0805-MFG]  (value not drawn)
U4  MT41J128M16HA-125  [MICT-HA-96]  (parts A,B,C of 3)
U5  TPS51200DRCR  [TPS51200DRCR]

### Nets
+1.5V: C129.2 C130.2 R41.1 U4.A1(VDDQ) U4.A8(VDDQ) U4.B2(VDD) U4.C1(VDDQ) U4.C9(VDDQ) U4.D2(VDDQ) U4.D9(VDD) U4.E9(VDDQ) U4.F1(VDDQ) U4.G7(VDD) U4.H2(VDDQ) U4.H9(VDDQ) U4.K2(VDD) U4.K8(VDD) U4.N1(VDD) U4.N9(VDD) U4.R1(VDD) U4.R9(VDD) U5.2(VLDOIN)
+3.3V: C121.2 C131.2 R43.2 U5.7(EN) U5.10(VIN)
DDR3_VREF: C100.1 C125.2 C126.2 U4.H1(VREFDQ) U4.M8(VREFCA) U5.6(REFOUT)
DDR3_VTT: C127.2 C128.2 R17.1 R18.1 R19.1 R20.1 R21.1 R22.1 R23.1 R24.1 R25.1 R26.1 R27.1 R28.1 R29.1 R30.1 R32.1 R33.1 R34.1 R36.1 R37.1 R38.1 U5.3(VO) U5.5(VOSNS)
GND: C100.2 C115.1 C121.1 C125.1 C126.1 C127.1 C128.1 C129.1 C130.1 C131.1 R39.1 R40.1 R42.2 U4.A9(VSS) U4.B1(VSSQ) U4.B3(VSS) U4.B9(VSSQ) U4.D1(VSSQ) U4.D8(VSSQ) U4.E1(VSS) U4.E2(VSSQ) U4.E8(VSSQ) U4.F9(VSSQ) U4.G1(VSSQ) U4.G8(VSS) U4.G9(VSSQ) U4.J2(VSS) U4.J8(VSS) U4.M1(VSS) U4.M9(VSS) U4.P1(VSS) U4.P9(VSS) U4.T1(VSS) U4.T9(VSS) U5.4(PGND) U5.8(GND) U5.11(EP_1)  [project net FPGA_M1]
DDR3_A0: R17.2 U4.N3(A0) ; off-sheet DDR3_A0
DDR3_A1: R23.2 U4.P7(A1) ; off-sheet DDR3_A1
DDR3_A2: R18.2 U4.P3(A2) ; off-sheet DDR3_A2
DDR3_A3: R19.2 U4.N2(A3) ; off-sheet DDR3_A3
DDR3_A4: R20.2 U4.P8(A4) ; off-sheet DDR3_A4
DDR3_A5: R24.2 U4.P2(A5) ; off-sheet DDR3_A5
DDR3_A6: R21.2 U4.R8(A6) ; off-sheet DDR3_A6
DDR3_A7: R25.2 U4.R2(A7) ; off-sheet DDR3_A7
DDR3_A8: R26.2 U4.T8(A8) ; off-sheet DDR3_A8
DDR3_A9: R22.2 U4.R3(A9) ; off-sheet DDR3_A9
DDR3_A10: R27.2 U4.L7(A10/AP) ; off-sheet DDR3_A10
DDR3_A11: R28.2 U4.R7(A11) ; off-sheet DDR3_A11
DDR3_A12: R29.2 U4.N7(A12/BC#) ; off-sheet DDR3_A12
DDR3_A13: R30.2 U4.T3(A13) ; off-sheet DDR3_A13
DDR3_BA0: R32.2 U4.M2(BA0) ; off-sheet DDR3_BA0
DDR3_BA1: R33.2 U4.N8(BA1) ; off-sheet DDR3_BA1
DDR3_BA2: R34.2 U4.M3(BA2) ; off-sheet DDR3_BA2
DDR3_CAS: R38.2 U4.K3(CAS#) ; off-sheet DDR3_CAS
DDR3_CKE: U4.K9(CKE) ; off-sheet DDR3_CKE
DDR3_CLK_N: R35.2 U4.K7(CK#) ; off-sheet DDR3_CLK_N  [project net DDR3_CLK0_N]
DDR3_CLK_P: R35.1 U4.J7(CK) ; off-sheet DDR3_CLK_P  [project net DDR3_CLK0_P]
DDR3_DQ0: U4.E3(DQ0) ; off-sheet DDR3_DQ0
DDR3_DQ1: U4.F7(DQ1) ; off-sheet DDR3_DQ1
DDR3_DQ2: U4.F2(DQ2) ; off-sheet DDR3_DQ2
DDR3_DQ3: U4.F8(DQ3) ; off-sheet DDR3_DQ3
DDR3_DQ4: U4.H3(DQ4) ; off-sheet DDR3_DQ4
DDR3_DQ5: U4.H8(DQ5) ; off-sheet DDR3_DQ5
DDR3_DQ6: U4.G2(DQ6) ; off-sheet DDR3_DQ6
DDR3_DQ7: U4.H7(DQ7) ; off-sheet DDR3_DQ7
DDR3_DQ8: U4.D7(DQ8) ; off-sheet DDR3_DQ8
DDR3_DQ9: U4.C3(DQ9) ; off-sheet DDR3_DQ9
DDR3_DQ10: U4.C8(DQ10) ; off-sheet DDR3_DQ10
DDR3_DQ11: U4.C2(DQ11) ; off-sheet DDR3_DQ11
DDR3_DQ12: U4.A7(DQ12) ; off-sheet DDR3_DQ12
DDR3_DQ13: U4.A2(DQ13) ; off-sheet DDR3_DQ13
DDR3_DQ14: U4.B8(DQ14) ; off-sheet DDR3_DQ14
DDR3_DQ15: U4.A3(DQ15) ; off-sheet DDR3_DQ15
DDR3_LDM: U4.E7(LDM) ; off-sheet DDR3_LDM
DDR3_LDQS_N: U4.G3(LDQS#) ; off-sheet DDR3_LDQS_N
DDR3_LDQS_P: U4.F3(LDQS) ; off-sheet DDR3_LDQS_P
DDR3_ODT: U4.K1(ODT) ; off-sheet DDR3_ODT
DDR3_RAS: R37.2 U4.J3(RAS#) ; off-sheet DDR3_RAS
DDR3_RESET_N: R40.2 U4.T2(RESET#) ; off-sheet DDR3_RESET_N
DDR3_S0: U4.L2(CS#) ; off-sheet DDR3_S0
DDR3_UDM: U4.D3(UDM) ; off-sheet DDR3_UDM
DDR3_UDQS_N: U4.B7(UDQS#) ; off-sheet DDR3_UDQS_N
DDR3_UDQS_P: U4.C7(UDQS) ; off-sheet DDR3_UDQS_P
DDR3_WE: R36.2 U4.L3(WE#) ; off-sheet DDR3_WE
NetC115_2: C115.2 R41.2 R42.1 U5.1(REFIN)
NetR39_2: R39.2 U4.L8(ZQ)
NetR43_1: R43.1 U5.9(PGOOD)

Not connected (* = marked no-connect by the designer): U4 J1(NC)* J9(NC)* L1(NC)* L9(NC)* M7(NC)* T7(NC)*; U5 12(EP_2)* 13(EP_3)* 14(EP_4)* 15(EP_5)*

### Library data of the parts
C100 C115 C121 C125-C131 = CMP-2007-01729-1: Manufacturer: Vitramon; Part Number: VJ0805Y152KXAAC
R17-R30 R32-R43 = CMP-02407-000217-1: as R1 on sheet Programming_and_Clock_FPGA; Weight: 0.000194oz; Package Quantity: 1000; Height: 0.52mm; Case Code (Imperial): 0805; Width: 1.25mm; Packaging: Tape and Reel; Case/Package: 0805; Length: 2mm; Composition: Thin Film; Termination: SMD/SMT; Min Operating Temperature: -55°C; Case Code (Metric): 2012; Max Operating Temperature: 155°C
U4 = CMP-0355-00025-1: 2Gb DDR3-1600 SDRAM, 128Mb x 16, 1.25ns, 1.5V, 0 to 95 degC, 96-Ball FBGA, Pb-Free; Manufacturer: Micron; Clock Rate: 800 MHzÂ; Op. Temp.: 0C to +95CÂ; Data Rate: DDR3-1600Â; Density: 2GbÂ; Voltage: 1.5VÂ; CL: CL = 11Â; Cycle Time: 1.25nsÂ; Pin Count: 96-ballÂ; Depth: 128MbÂ; DatasheetVersion: Rev. P; ComponentLink1URL: http://www.micron.com/; Mounting Technology: Surface Mount; PackageVersion: Rev.E; ComponentLink3URL: http://www.micron.com/~/media/Documents/Products/Data%20Sheet/DRAM/4Gb_1_35V_DDR3L.pdf; RoHS: YesÂ; ComponentLink2URL: http://www.micron.com/~/media/Documents/Products/Data%20Sheet/DRAM/2Gb_DDR3_SDRAM.pdf; PartNumber: MT41J128M16HA-125; ComponentLink3Description: Package Specification; ComponentLink1Description: Manufacturer URL; PackageDescription: 96-Ball Fine-Pitch Ball Grid Array, 14 x 9 mm, Pitch 0.8 mm; PackageReference: MICT-HA-96; Width: x16Â; Package: FBGAÂ; ComponentLink2Description: Datasheet
U5 = TPS51200DRCR: Integrated Circuit; Manufacturer_Name: Texas Instruments; Datasheet Link: https://www.ti.com/lit/gpn/tps51200?HQS=ti-null-null-sf-df-pf-sep-wwe&DCM=yes; Height: 1mm; Manufacturer_Part_Number: TPS51200DRCR; Mouser Part Number: 595-TPS51200DRCR; Mouser Price/Stock: https://www.mouser.co.uk/ProductDetail/Texas-Instruments/TPS51200DRCR?qs=WxL8HmPi5r54D5pDlo3K5g%3D%3D; Arrow Part Number: TPS51200DRCR; Arrow Price/Stock: https://www.arrow.com/en/products/tps51200drcr/texas-instruments?region=nac

## Sheet MIPI_Interface.SchDoc
size A4; SheetNumber: 3; SheetTotal: 6
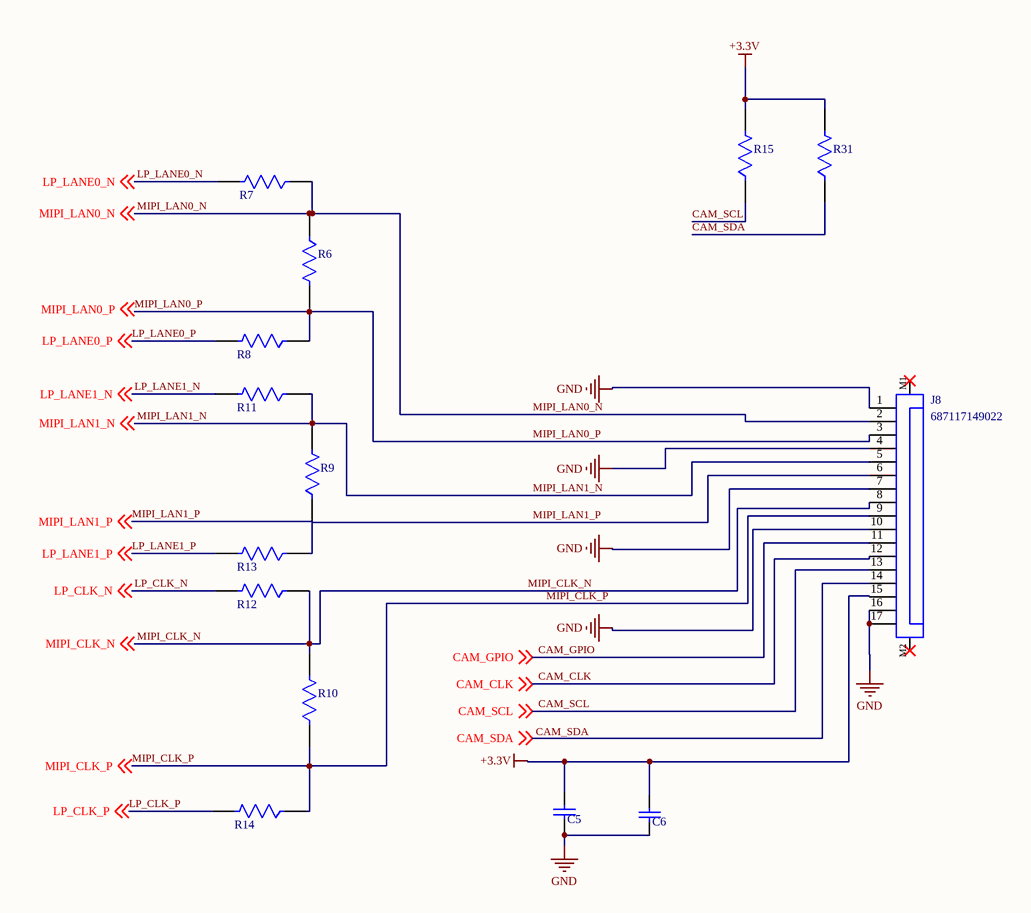
[diagram p5: MIPI_Interface.SchDoc]

### Parts
C5  VJ0805Y152KXAAC  [CAPC2013X145X48NL20T23]  (value not drawn)
C6  VJ0805Y152KXAAC  [CAPC2013X145X48NL20T23]  (value not drawn)
J8  687117149022  [687117149022]
R6  MCU0805MD4991BP100  [FP-MCU0805-MFG]  (value not drawn)
R7  MCU0805MD4991BP100  [FP-MCU0805-MFG]  (value not drawn)
R8  MCU0805MD4991BP100  [FP-MCU0805-MFG]  (value not drawn)
R9  MCU0805MD4991BP100  [FP-MCU0805-MFG]  (value not drawn)
R10  MCU0805MD4991BP100  [FP-MCU0805-MFG]  (value not drawn)
R11  MCU0805MD4991BP100  [FP-MCU0805-MFG]  (value not drawn)
R12  MCU0805MD4991BP100  [FP-MCU0805-MFG]  (value not drawn)
R13  MCU0805MD4991BP100  [FP-MCU0805-MFG]  (value not drawn)
R14  MCU0805MD4991BP100  [FP-MCU0805-MFG]  (value not drawn)
R15  MCU0805MD4991BP100  [FP-MCU0805-MFG]  (value not drawn)
R31  MCU0805MD4991BP100  [FP-MCU0805-MFG]  (value not drawn)

### Nets
+3.3V: C5.2 C6.2 J8.15 R15.2 R31.2
GND: C5.1 C6.1 J8.1 J8.4 J8.7 J8.10 J8.16 J8.17  [project net FPGA_M1]
CAM_CLK: J8.12 ; off-sheet CAM_CLK
CAM_GPIO: J8.11 ; off-sheet CAM_GPIO
CAM_SCL: J8.13 R15.1 ; off-sheet CAM_SCL
CAM_SDA: J8.14 R31.1 ; off-sheet CAM_SDA
LP_CLK_N: R12.2 ; off-sheet LP_CLK_N
LP_CLK_P: R14.2 ; off-sheet LP_CLK_P
LP_LANE0_N: R7.2 ; off-sheet LP_LANE0_N
LP_LANE0_P: R8.2 ; off-sheet LP_LANE0_P
LP_LANE1_N: R11.2 ; off-sheet LP_LANE1_N
LP_LANE1_P: R13.2 ; off-sheet LP_LANE1_P
MIPI_CLK_N: J8.8 R10.2 R12.1 ; off-sheet MIPI_CLK_N
MIPI_CLK_P: J8.9 R10.1 R14.1 ; off-sheet MIPI_CLK_P
MIPI_LAN0_N: J8.2 R6.1 R7.1 ; off-sheet MIPI_LAN0_N
MIPI_LAN0_P: J8.3 R6.2 R8.1 ; off-sheet MIPI_LAN0_P
MIPI_LAN1_N: J8.5 R9.2 R11.1 ; off-sheet MIPI_LAN1_N
MIPI_LAN1_P: J8.6 R9.1 R13.1 ; off-sheet MIPI_LAN1_P

Not connected (* = marked no-connect by the designer): J8 M1* M2*

### Notes on the sheet
- Labels drawn without touching a wire or pin: CAM_SDA, MIPI_LAN0_P

### Library data of the parts
C5 C6 = CMP-2007-01729-1: Manufacturer: Vitramon; Part Number: VJ0805Y152KXAAC
J8 = CMP-1502-01629-3: SMT ZIF Connectors Hinge Type WR-FPC, Horizontal, Bottom Contact, pitch 0.5 mm, 17 pins; Number of Contacts: 17; Voltage Rating: 50V; Wire/Cable Type: Straight; Pitch: 508µm; Actuator Material: Nylon, Polyamide; Contact Resistance: 50mΩ; Gender: Receptacle; Current Rating: 500mA; Packaging: Tape and Reel; REACH SVHC: Unknown; Contact Material: Bronze; Mount: Surface Mount; RoHS: Compliant; Min Operating Temperature: -40°C; Flammability Rating: UL94 V-0; Number of Pins: 17; Number of Rows: 1; Termination: Solder; Number of Positions: 17; Max Operating Temperature: 105°C; Contact Plating: Tin; Orientation: Horizontal; Operating Supply Voltage: 50V; Lead Pitch: 500µm
R6-R15 R31 = CMP-02407-000217-1: as R1 on sheet Programming_and_Clock_FPGA; Weight: 0.000194oz; Package Quantity: 1000; Height: 0.52mm; Case Code (Imperial): 0805; Width: 1.25mm; Packaging: Tape and Reel; Case/Package: 0805; Length: 2mm; Composition: Thin Film; Termination: SMD/SMT; Min Operating Temperature: -55°C; Case Code (Metric): 2012; Max Operating Temperature: 155°C

## Sheet LEDS_And_Buttons.SchDoc
size A4; SheetNumber: 4; SheetTotal: 6
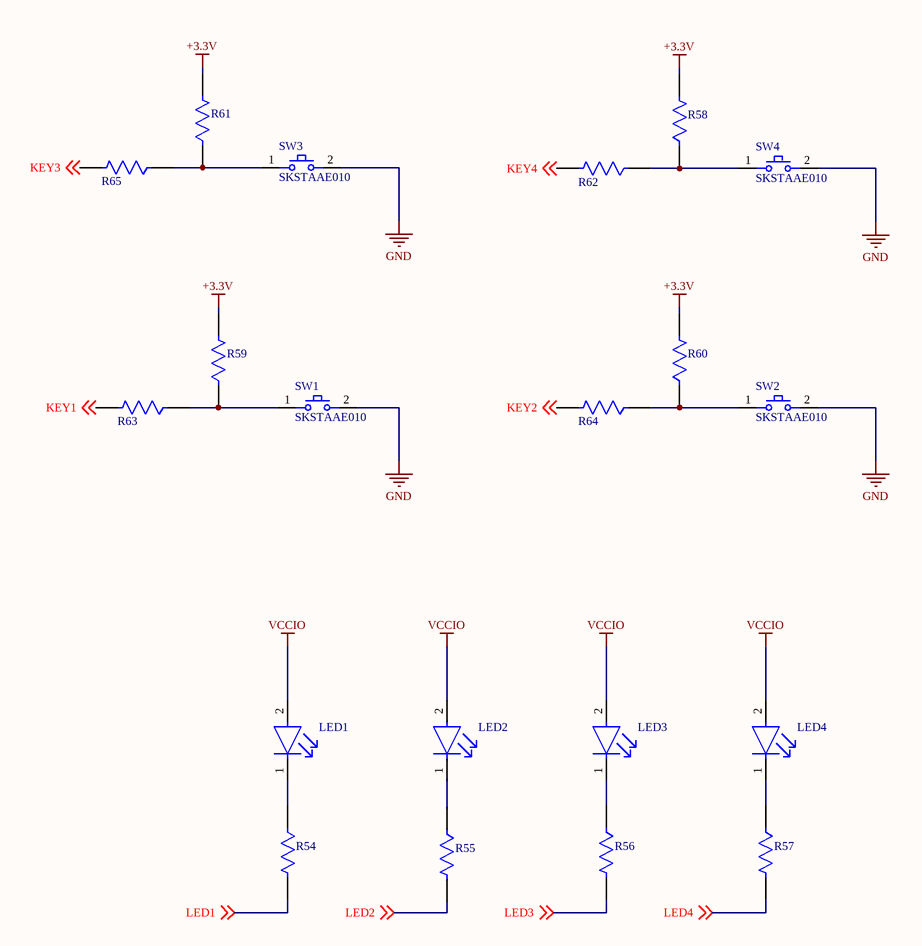
[diagram p6: LEDS_And_Buttons.SchDoc]

### Parts
LED1  LTST-C230EKT  [FP-LTST-C230EKT-MFG]  (value not drawn)
LED2  LTST-C230EKT  [FP-LTST-C230EKT-MFG]  (value not drawn)
LED3  LTST-C230EKT  [FP-LTST-C230EKT-MFG]  (value not drawn)
LED4  LTST-C230EKT  [FP-LTST-C230EKT-MFG]  (value not drawn)
R54  MCU0805MD4991BP100  [FP-MCU0805-MFG]  (value not drawn)
R55  MCU0805MD4991BP100  [FP-MCU0805-MFG]  (value not drawn)
R56  MCU0805MD4991BP100  [FP-MCU0805-MFG]  (value not drawn)
R57  MCU0805MD4991BP100  [FP-MCU0805-MFG]  (value not drawn)
R58  MCU0805MD4991BP100  [FP-MCU0805-MFG]  (value not drawn)
R59  MCU0805MD4991BP100  [FP-MCU0805-MFG]  (value not drawn)
R60  MCU0805MD4991BP100  [FP-MCU0805-MFG]  (value not drawn)
R61  MCU0805MD4991BP100  [FP-MCU0805-MFG]  (value not drawn)
R62  MCU0805MD4991BP100  [FP-MCU0805-MFG]  (value not drawn)
R63  MCU0805MD4991BP100  [FP-MCU0805-MFG]  (value not drawn)
R64  MCU0805MD4991BP100  [FP-MCU0805-MFG]  (value not drawn)
R65  MCU0805MD4991BP100  [FP-MCU0805-MFG]  (value not drawn)
SW1  SKSTAAE010  [FP-SKSTAAE010-MFG]
SW2  SKSTAAE010  [FP-SKSTAAE010-MFG]
SW3  SKSTAAE010  [FP-SKSTAAE010-MFG]
SW4  SKSTAAE010  [FP-SKSTAAE010-MFG]

### Nets
+3.3V: R58.2 R59.2 R60.2 R61.2
GND: SW1.2 SW2.2 SW3.2 SW4.2  [project net FPGA_M1]
VCCIO: LED1.2(A) LED2.2(A) LED3.2(A) LED4.2(A)
KEY1: R63.2 ; off-sheet KEY1
KEY2: R64.2 ; off-sheet KEY2
KEY3: R65.2 ; off-sheet KEY3
KEY4: R62.2 ; off-sheet KEY4
LED1: R54.2 ; off-sheet LED1
LED2: R55.2 ; off-sheet LED2
LED3: R56.2 ; off-sheet LED3
LED4: R57.2 ; off-sheet LED4
NetLED1_1: LED1.1(C) R54.1
NetLED2_1: LED2.1(C) R55.1
NetLED3_1: LED3.1(C) R56.1
NetLED4_1: LED4.1(C) R57.1
NetR58_1: R58.1 R62.1 SW4.1
NetR59_1: R59.1 R63.1 SW1.1
NetR60_1: R60.1 R64.1 SW2.1
NetR61_1: R61.1 R65.1 SW3.1

### Library data of the parts
LED1-LED4 = CMP-22017-000030-1: LED RED CLEAR CHIP SMD; Forward Current: 30mA; Test Current: 10mA; Number of Elements: 1; Viewing Angle: 130°; Dominant Wavelength: 621nm; Forward Voltage: 2V; Lens Style: Diffused; Power Rating: 100mW; Reverse Voltage: 5V; Wavelength: 630nm; Luminous Intensity: 6mcd; Lens Color: Colorless; Case/Package: 1206; Case Code (Imperial): 1206; Package Quantity: 1; Lead Free: Lead Free; Case Code (Metric): 3216; Height: 1.1mm; Lens Transparency: Clear; Mount: Surface Mount; Depth: 1.6mm; Number of LEDs: 1; Power Dissipation: 100mW; Max Operating Temperature: 85°C; Width: 1.6mm; Color: Red; Number of Pins: 2; Min Operating Temperature: -55°C; Packaging: Tape and Reel; Radiation Hardening: No; Illumination Color: Red; Length: 3.2mm
R54-R65 = CMP-02407-000217-1: as R1 on sheet Programming_and_Clock_FPGA; Weight: 0.000194oz; Package Quantity: 1000; Height: 0.52mm; Case Code (Imperial): 0805; Width: 1.25mm; Packaging: Tape and Reel; Case/Package: 0805; Length: 2mm; Composition: Thin Film; Termination: SMD/SMT; Min Operating Temperature: -55°C; Case Code (Metric): 2012; Max Operating Temperature: 155°C
SW1-SW4 = CMP-24311-000002-1: Tactile Switches Quiet 0.9mm Middle Stroke, 4N,500KCycle; Lead Free: Lead Free

## Sheet HDMI.SchDoc
size A4; SheetNumber: 5; SheetTotal: 6
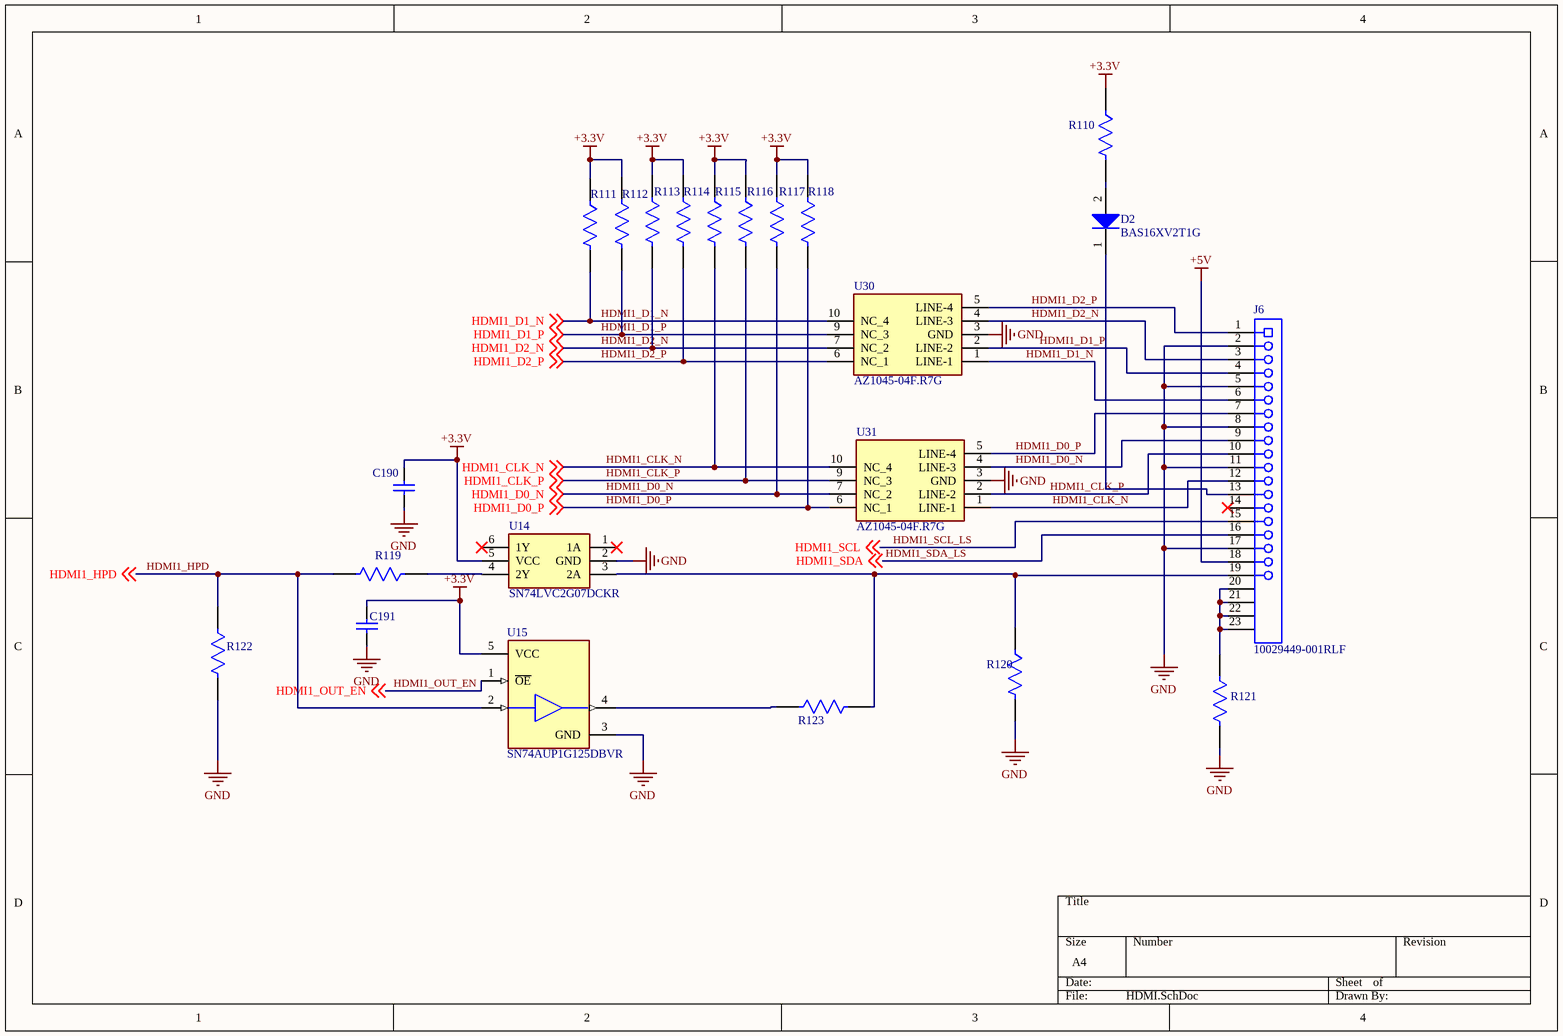
[diagram p7: HDMI.SchDoc]

### Parts
C190  VJ0805Y152KXAAC  [CAPC2013X145X48NL20T23]  (value not drawn)
C191  VJ0805Y152KXAAC  [CAPC2013X145X48NL20T23]  (value not drawn)
D2  BAS16XV2T1G  [ONSC-SOD-523-2-502-01_V]
J6  10029449-001RLF  [FCI-10029449-001RLF_V]
R110  MCU0805MD4991BP100  [FP-MCU0805-MFG]  (value not drawn)
R111  MCU0805MD4991BP100  [FP-MCU0805-MFG]  (value not drawn)
R112  MCU0805MD4991BP100  [FP-MCU0805-MFG]  (value not drawn)
R113  MCU0805MD4991BP100  [FP-MCU0805-MFG]  (value not drawn)
R114  MCU0805MD4991BP100  [FP-MCU0805-MFG]  (value not drawn)
R115  MCU0805MD4991BP100  [FP-MCU0805-MFG]  (value not drawn)
R116  MCU0805MD4991BP100  [FP-MCU0805-MFG]  (value not drawn)
R117  MCU0805MD4991BP100  [FP-MCU0805-MFG]  (value not drawn)
R118  MCU0805MD4991BP100  [FP-MCU0805-MFG]  (value not drawn)
R119  MCU0805MD4991BP100  [FP-MCU0805-MFG]  (value not drawn)
R120  MCU0805MD4991BP100  [FP-MCU0805-MFG]  (value not drawn)
R121  MCU0805MD4991BP100  [FP-MCU0805-MFG]  (value not drawn)
R122  MCU0805MD4991BP100  [FP-MCU0805-MFG]  (value not drawn)
R123  MCU0805MD4991BP100  [FP-MCU0805-MFG]  (value not drawn)
U14  SN74LVC2G07DCKR  [SOT65P210X110-6N]
U15  SN74AUP1G125DBVR  [FP-DBV0005A-IPC_C]
U30  AZ1045-04F.R7G  [AZ104504FR7G]
U31  AZ1045-04F.R7G  [AZ104504FR7G]

### Nets
+3.3V: C190.2 C191.2 R110.1 R111.1 R112.1 R113.1 R114.1 R115.1 R116.1 R117.1 R118.1 U14.5(VCC) U15.5(VCC)
+5V: J6.18
GND: C190.1 C191.1 J6.2 J6.5 J6.8 J6.11 J6.17 R120.2 R121.2 R122.2 U14.2(GND) U15.3(GND) U30.3(GND) U31.3(GND)  [project net FPGA_M1]
HDMI1_CLK_N: J6.12 R115.2 U31.1(LINE-1) U31.10(NC_4) ; off-sheet HDMI1_CLK_N
HDMI1_CLK_P: J6.10 R116.2 U31.2(LINE-2) U31.9(NC_3) ; off-sheet HDMI1_CLK_P
HDMI1_D0_N: J6.9 R117.2 U31.4(LINE-3) U31.7(NC_2) ; off-sheet HDMI1_D0_N
HDMI1_D0_P: J6.7 R118.2 U31.5(LINE-4) U31.6(NC_1) ; off-sheet HDMI1_D0_P
HDMI1_D1_N: J6.6 R111.2 U30.1(LINE-1) U30.10(NC_4) ; off-sheet HDMI1_D1_N
HDMI1_D1_P: J6.4 R112.2 U30.2(LINE-2) U30.9(NC_3) ; off-sheet HDMI1_D1_P
HDMI1_D2_N: J6.3 R113.2 U30.4(LINE-3) U30.7(NC_2) ; off-sheet HDMI1_D2_N
HDMI1_D2_P: J6.1 R114.2 U30.5(LINE-4) U30.6(NC_1) ; off-sheet HDMI1_D2_P
HDMI1_HPD: R119.2 R122.1 U15.2(A) ; off-sheet HDMI1_HPD
HDMI1_OUT_EN: U15.1(~{OE}) ; off-sheet HDMI1_OUT_EN
HDMI1_SCL: J6.15 ; off-sheet HDMI1_SCL  [also labelled HDMI1_SCL_LS]
HDMI1_SDA: J6.16 ; off-sheet HDMI1_SDA  [also labelled HDMI1_SDA_LS]
NetD2_1: D2.1(K) J6.13
NetD2_2: D2.2(A) R110.2
NetJ6_19: J6.19 R120.1 R123.2 U14.3(2A)
NetJ6_20: J6.20(SHLD1) J6.21(SHLD2) J6.22(SHLD3) J6.23(SHLD4) R121.1
NetR119_1: R119.1 U14.4(2Y)
NetR123_1: R123.1 U15.4(Y)

Not connected (* = marked no-connect by the designer): J6 14*; U14 1(1A)* 6(1Y)*

### Library data of the parts
C190 C191 = CMP-2007-01729-1: Manufacturer: Vitramon; Part Number: VJ0805Y152KXAAC
D2 = CMP-1054-00076-1: Switching Diode, 2-Pin SOD-523, Pb-Free, Tape and Reel; Manufacturer: On Semiconductor; trr Max (ns): 6; Configuration: Single; IF Max (A): 0.2; ComponentLink1URL: http://www.onsemi.com/; DatasheetVersion: Rev. 7; RoHS: TRUE; PackageVersion: Rev. E, 09/2010; Packing: Tape and Reel; ComponentLink2Description: Datasheet; ComponentLink2URL: http://www.onsemi.com/pub_link/Collateral/BAS16XV2T1-D.PDF; ComponentLink3Description: Package Specification; PackageReference: SOD-523-2-502-01; ComponentLink1Description: Manufacturer URL; PartNumber: BAS16XV2T1G; Mounting Technology: Surface Mount; PackageDescription: 2-Pin SOD, Body 1.2 x 0.8 mm; ComponentLink3URL: http://www.onsemi.com/pub_link/Collateral/502-01.PDF
J6 = CMP-1698-00003-1: Surface Mount Type A HDMI Receptacle without Flange, 19 Positions, 0.5 mm Pitch, -55 to 85 degC, RoHS, Tape and Reel; RoHSCompliant: false; PackageDescription: 19-Pin Surface Mount Device, Body 15 x 9 mm, Pitch 0.5 mm; ComponentLink1Description: Manufacturer URL; PackageReference: 10029449-001RLF; DatasheetVersion: Rev. S, 06/2012; ComponentLink1URL: http://portal.fciconnect.com/; ComponentLink2Description: Datasheet; ComponentLink2URL: https://datasheet.ciiva.com/851/10029449-851120.pdf
R110-R123 = CMP-02407-000217-1: as R1 on sheet Programming_and_Clock_FPGA; Weight: 0.000194oz; Package Quantity: 1000; Height: 0.52mm; Case Code (Imperial): 0805; Width: 1.25mm; Packaging: Tape and Reel; Case/Package: 0805; Length: 2mm; Composition: Thin Film; Termination: SMD/SMT; Min Operating Temperature: -55°C; Case Code (Metric): 2012; Max Operating Temperature: 155°C
U14 = SN74LVC2G07DCKR: Integrated Circuit; Manufacturer_Name: Texas Instruments; Datasheet Link: https://datasheet.lcsc.com/szlcsc/Texas-Instruments-TI-SN74LVC2G07DCKR_C7849.pdf; Height: 1.1mm; Manufacturer_Part_Number: SN74LVC2G07DCKR; Mouser Part Number: 595-SN74LVC2G07DCKR; Mouser Price/Stock: https://www.mouser.co.uk/ProductDetail/Texas-Instruments/SN74LVC2G07DCKR?qs=EIjG%252BN7kn%252Bn6uhrXwDLE9Q%3D%3D; Arrow Part Number: SN74LVC2G07DCKR; Arrow Price/Stock: https://www.arrow.com/en/products/sn74lvc2g07dckr/texas-instruments?region=nac
U15 = CMP-0859-00054-4: IC BUF NON-INVERT 3.6V SOT23-5; Propagation Delay: 18.7ns; Number of Elements: 1; High Level Output Current: -4mA; Quiescent Current: 500nA; Min Supply Voltage: 800mV; Output Type: 3-STATE; Logic Function: Buffer; Polarity: Non-Inverting; Turn-On Delay Time: 25.5ns; Low Level Output Current: 4mA; Lead Free: Lead Free; Number of Pins: 5; REACH SVHC: No SVHC; Radiation Hardening: No; Series: 74AUP; Packaging: Tape and Reel; Number of Channels: 1; Number of Outputs: 1; Number of Output Lines: 1; Max Operating Temperature: 85°C; Max Supply Voltage: 3.6V; Min Operating Temperature: -40°C; Number of Bits per Element: 1; Technology: CMOS; Number of Input Lines: 1; Case/Package: SOT-23; Number of Inputs: 1; Mount: Surface Mount; Number of Gates: 1; Number of Bits: 1; Package Quantity: 3000; RoHS Compliant: Yes
U30 U31 = AZ1045-04F.R7G: Diode ESD (Uni-directional); Manufacturer_Name: Amazing Microelectronic Corp.; Datasheet Link: https://download.datasheets.com/pdfs/2013/10/3/2/31/47/175/amzng_/manual/az1045-04f_datasheet.pdf?_ga=2.166408059.458781722.1648096097-1927931834.1642822301; Height: 0.55mm; Manufacturer_Part_Number: AZ1045-04F.R7G

## Sheet Power_supply.SchDoc
size A4; SheetNumber: 6; SheetTotal: 6
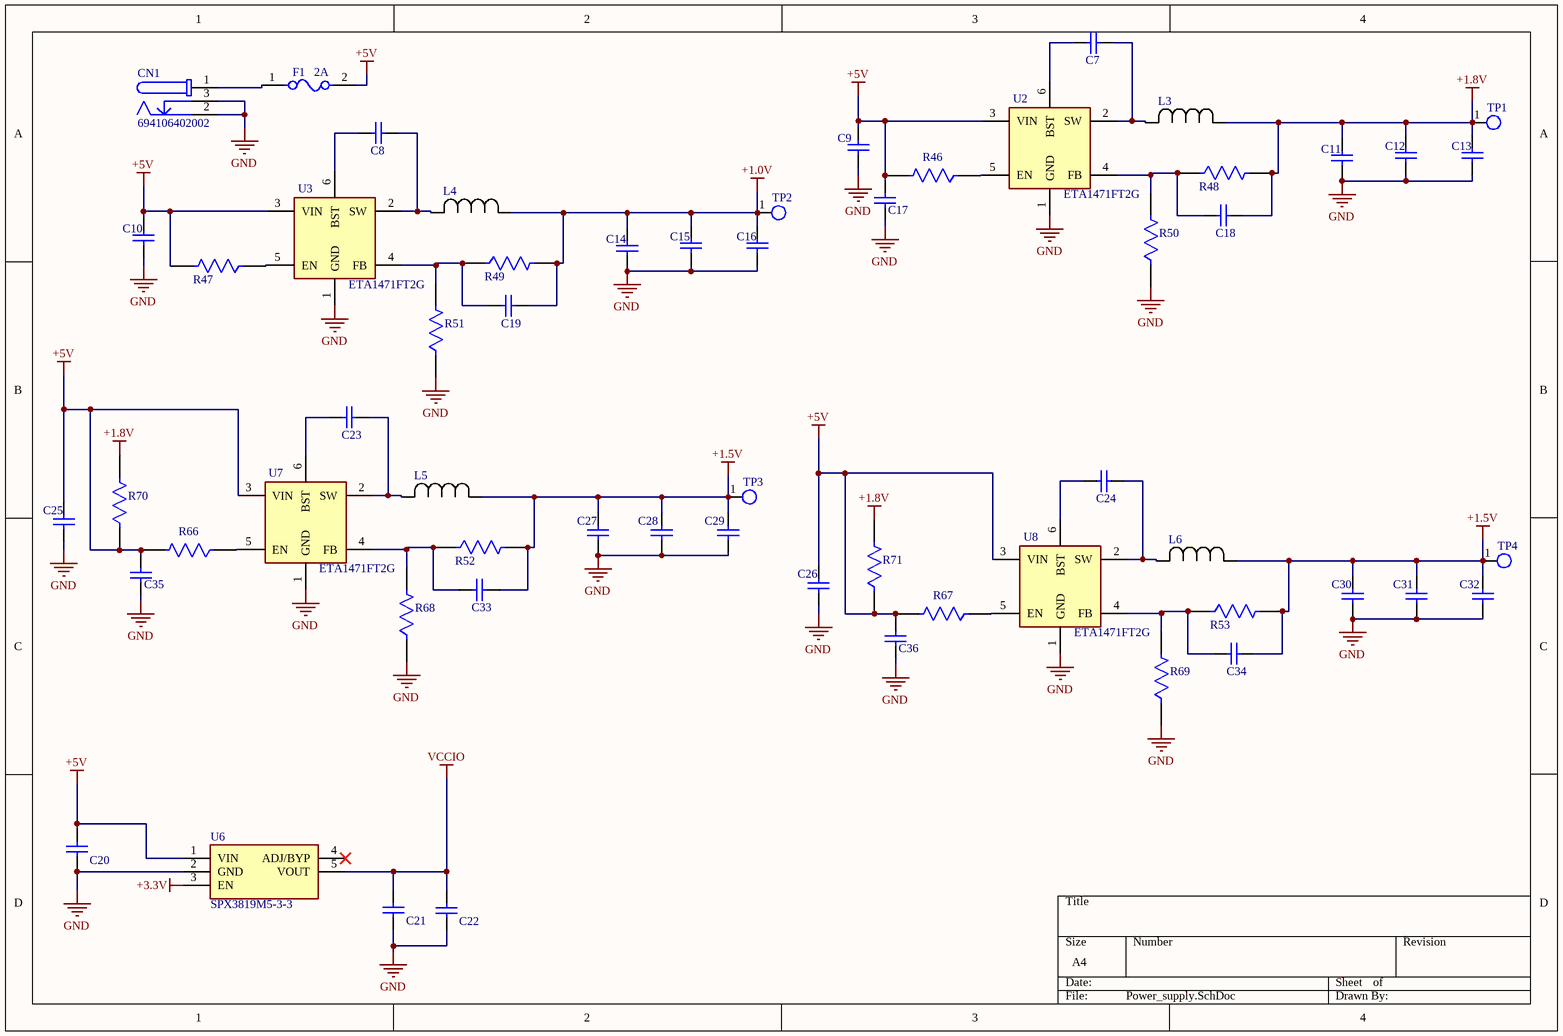
[diagram p8: Power_supply.SchDoc]

### Parts
C7  VJ0805Y152KXAAC  [CAPC2013X145X48NL20T23]  (value not drawn)
C8  VJ0805Y152KXAAC  [CAPC2013X145X48NL20T23]  (value not drawn)
C9  VJ0805Y152KXAAC  [CAPC2013X145X48NL20T23]  (value not drawn)
C10  VJ0805Y152KXAAC  [CAPC2013X145X48NL20T23]  (value not drawn)
C11  VJ0805Y152KXAAC  [CAPC2013X145X48NL20T23]  (value not drawn)
C12  VJ0805Y152KXAAC  [CAPC2013X145X48NL20T23]  (value not drawn)
C13  VJ0805Y152KXAAC  [CAPC2013X145X48NL20T23]  (value not drawn)
C14  VJ0805Y152KXAAC  [CAPC2013X145X48NL20T23]  (value not drawn)
C15  VJ0805Y152KXAAC  [CAPC2013X145X48NL20T23]  (value not drawn)
C16  VJ0805Y152KXAAC  [CAPC2013X145X48NL20T23]  (value not drawn)
C17  VJ0805Y152KXAAC  [CAPC2013X145X48NL20T23]  (value not drawn)
C18  VJ0805Y152KXAAC  [CAPC2013X145X48NL20T23]  (value not drawn)
C19  VJ0805Y152KXAAC  [CAPC2013X145X48NL20T23]  (value not drawn)
C20  VJ0805Y152KXAAC  [CAPC2013X145X48NL20T23]  (value not drawn)
C21  VJ0805Y152KXAAC  [CAPC2013X145X48NL20T23]  (value not drawn)
C22  VJ0805Y152KXAAC  [CAPC2013X145X48NL20T23]  (value not drawn)
C23  VJ0805Y152KXAAC  [CAPC2013X145X48NL20T23]  (value not drawn)
C24  VJ0805Y152KXAAC  [CAPC2013X145X48NL20T23]  (value not drawn)
C25  VJ0805Y152KXAAC  [CAPC2013X145X48NL20T23]  (value not drawn)
C26  VJ0805Y152KXAAC  [CAPC2013X145X48NL20T23]  (value not drawn)
C27  VJ0805Y152KXAAC  [CAPC2013X145X48NL20T23]  (value not drawn)
C28  VJ0805Y152KXAAC  [CAPC2013X145X48NL20T23]  (value not drawn)
C29  VJ0805Y152KXAAC  [CAPC2013X145X48NL20T23]  (value not drawn)
C30  VJ0805Y152KXAAC  [CAPC2013X145X48NL20T23]  (value not drawn)
C31  VJ0805Y152KXAAC  [CAPC2013X145X48NL20T23]  (value not drawn)
C32  VJ0805Y152KXAAC  [CAPC2013X145X48NL20T23]  (value not drawn)
C33  VJ0805Y152KXAAC  [CAPC2013X145X48NL20T23]  (value not drawn)
C34  VJ0805Y152KXAAC  [CAPC2013X145X48NL20T23]  (value not drawn)
C35  VJ0805Y152KXAAC  [CAPC2013X145X48NL20T23]  (value not drawn)
C36  VJ0805Y152KXAAC  [CAPC2013X145X48NL20T23]  (value not drawn)
CN1  694106402002  [694106402002]
F1  2A  [FP-0683G-MFG]
L3  ASPIAIG-FLR4020-3R3M-T  [IND_ASPIAIG-F4020_ABR]  (value not drawn)
L4  ASPIAIG-FLR4020-3R3M-T  [IND_ASPIAIG-F4020_ABR]  (value not drawn)
L5  ASPIAIG-FLR4020-3R3M-T  [IND_ASPIAIG-F4020_ABR]  (value not drawn)
L6  ASPIAIG-FLR4020-3R3M-T  [IND_ASPIAIG-F4020_ABR]  (value not drawn)
R46  MCU0805MD4991BP100  [FP-MCU0805-MFG]  (value not drawn)
R47  MCU0805MD4991BP100  [FP-MCU0805-MFG]  (value not drawn)
R48  MCU0805MD4991BP100  [FP-MCU0805-MFG]  (value not drawn)
R49  MCU0805MD4991BP100  [FP-MCU0805-MFG]  (value not drawn)
R50  MCU0805MD4991BP100  [FP-MCU0805-MFG]  (value not drawn)
R51  MCU0805MD4991BP100  [FP-MCU0805-MFG]  (value not drawn)
R52  MCU0805MD4991BP100  [FP-MCU0805-MFG]  (value not drawn)
R53  MCU0805MD4991BP100  [FP-MCU0805-MFG]  (value not drawn)
R66  MCU0805MD4991BP100  [FP-MCU0805-MFG]  (value not drawn)
R67  MCU0805MD4991BP100  [FP-MCU0805-MFG]  (value not drawn)
R68  MCU0805MD4991BP100  [FP-MCU0805-MFG]  (value not drawn)
R69  MCU0805MD4991BP100  [FP-MCU0805-MFG]  (value not drawn)
R70  MCU0805MD4991BP100  [FP-MCU0805-MFG]  (value not drawn)
R71  MCU0805MD4991BP100  [FP-MCU0805-MFG]  (value not drawn)
TP1  testpoint  (value not drawn)
TP2  testpoint  (value not drawn)
TP3  testpoint  (value not drawn)
TP4  testpoint  (value not drawn)
U2  ETA1471FT2G  [SOT95P280X110-6N]
U3  ETA1471FT2G  [SOT95P280X110-6N]
U6  SPX3819M5-3-3  [SOT95P280X145-5N]
U7  ETA1471FT2G  [SOT95P280X110-6N]
U8  ETA1471FT2G  [SOT95P280X110-6N]

### Nets
+1.0V: C14.2 C15.2 C16.2 C19.1 L4.1 R49.2 TP2.1
+1.5V: C27.2 C28.2 C29.2 C30.2 C31.2 C32.2 C33.1 C34.1 L5.1 L6.1 R52.2 R53.2 TP3.1 TP4.1
+1.8V: C11.2 C12.2 C13.2 C18.1 L3.1 R48.2 R70.2 R71.2 TP1.1
+3.3V: U6.3(EN)
+5V: C9.1 C10.1 C17.1 C20.1 C25.1 C26.1 C35.1 C36.1 F1.2 R46.2 R47.2 R66.2 R67.2 R70.1 R71.1 U2.3(VIN) U3.3(VIN) U6.1(VIN) U7.3(VIN) U8.3(VIN)
GND: C9.2 C10.2 C11.1 C12.1 C13.1 C14.1 C15.1 C16.1 C17.2 C20.2 C21.2 C22.2 C25.2 C26.2 C27.1 C28.1 C29.1 C30.1 C31.1 C32.1 C35.2 C36.2 CN1.2 CN1.3 R50.1 R51.1 R68.1 R69.1 U2.1(GND) U3.1(GND) U6.2(GND) U7.1(GND) U8.1(GND)  [project net FPGA_M1]
VCCIO: C21.1 C22.1 U6.5(VOUT)
NetC7_1: C7.1 L3.2 U2.2(SW)
NetC7_2: C7.2 U2.6(BST)
NetC8_1: C8.1 L4.2 U3.2(SW)
NetC8_2: C8.2 U3.6(BST)
NetC18_2: C18.2 R48.1 R50.2 U2.4(FB)
NetC19_2: C19.2 R49.1 R51.2 U3.4(FB)
NetC23_1: C23.1 L5.2 U7.2(SW)
NetC23_2: C23.2 U7.6(BST)
NetC24_1: C24.1 L6.2 U8.2(SW)
NetC24_2: C24.2 U8.6(BST)
NetC33_2: C33.2 R52.1 R68.2 U7.4(FB)
NetC34_2: C34.2 R53.1 R69.2 U8.4(FB)
NetCN1_1: CN1.1 F1.1
NetR46_1: R46.1 U2.5(EN)
NetR47_1: R47.1 U3.5(EN)
NetR66_1: R66.1 U7.5(EN)
NetR67_1: R67.1 U8.5(EN)

Not connected (* = marked no-connect by the designer): U6 4(ADJ/BYP)*

### Library data of the parts
C7-C36 = CMP-2007-01729-1: Manufacturer: Vitramon; Part Number: VJ0805Y152KXAAC
CN1 = CMP-1502-00189-3: DC Power Jack Connector WR-DC, Male, Vertical, THT, 3 A, 20 V; Voltage Rating: 30V; Shielding: Unshielded; Operating Supply Voltage: 20V; Current Rating: 3A; Number of Contacts: 1; Insulation Resistance: 100MΩ; Max Operating Temperature: 85°C; Height: 14.3mm; Orientation: Vertical; REACH SVHC: Unknown; RoHS: Compliant; Min Operating Temperature: -40°C; Termination: Through Hole; Contact Material: Gold; Flammability Rating: UL94 V-0; Voltage Rating (DC): 20V; Housing Material: Polyamide; Mount: Through Hole; Connector Type: Power; Contact Gender: Female; Color: Black; Gender: Male; Contact Plating: Tin; Packaging: Bulk
F1 = CMP-16042-000016-1: FUSE SLOW 125VDC 350VAC 2A
L3-L6 = ASPIAIG-FLR4020-3R3M-T: Description; Manufacturer_Name: Abracon; Copyright: Copyright (C) 2026 Ultra Librarian. All rights reserved.; Manufacturer_Part_Number: ASPIAIG-FLR4020-3R3M-T
R46-R53 R66-R71 = CMP-02407-000217-1: as R1 on sheet Programming_and_Clock_FPGA; Weight: 0.000194oz; Package Quantity: 1000; Height: 0.52mm; Case Code (Imperial): 0805; Width: 1.25mm; Packaging: Tape and Reel; Case/Package: 0805; Length: 2mm; Composition: Thin Film; Termination: SMD/SMT; Min Operating Temperature: -55°C; Case Code (Metric): 2012; Max Operating Temperature: 155°C
U2 U3 U7 U8 = ETA1471FT2G: Integrated Circuit; Manufacturer_Name: ETA Solutions; Datasheet Link: https://atlas.eefcdn.com/partdatasheet/700056/700056_26425269_1757294122249.pdf; Height: 1.1mm; Manufacturer_Part_Number: ETA1471FT2G
U6 = SPX3819M5-3-3: Integrated Circuit; Manufacturer_Name: EXAR; Datasheet Link: https://www.alldatasheet.com/datasheet-pdf/download/190079/SIPEX/SPX3819M5-3-3.html; Height: 1.45mm; Manufacturer_Part_Number: SPX3819M5-3-3; Mouser Part Number: N/A; Mouser Price/Stock: https://www.mouser.com/Search/Refine.aspx?Keyword=N%2FA

## Nets that join several sheets
+1.0V: Programming_and_Clock_FPGA (17 pins), Power_supply (7 pins)
+1.5V: Programming_and_Clock_FPGA (6 pins), RAM (22 pins), Power_supply (14 pins)
+1.8V: Programming_and_Clock_FPGA (7 pins), Power_supply (9 pins)
+3.3V: Programming_and_Clock_FPGA (17 pins), RAM (5 pins), MIPI_Interface (5 pins), LEDS_And_Buttons (R58.2 R59.2 R60.2 R61.2), HDMI (13 pins), Power_supply (U6.3)
+5V: HDMI (J6.18), Power_supply (20 pins)
FPGA_M1: Programming_and_Clock_FPGA (101 pins), RAM (37 pins), MIPI_Interface (8 pins), LEDS_And_Buttons (SW1.2 SW2.2 SW3.2 SW4.2), HDMI (14 pins), Power_supply (33 pins)
VCCIO: Programming_and_Clock_FPGA (6 pins), LEDS_And_Buttons (LED1.2 LED2.2 LED3.2 LED4.2), Power_supply (C21.1 C22.1 U6.5)
CAM_CLK: Programming_and_Clock_FPGA (U1.H14), MIPI_Interface (J8.12)
CAM_GPIO: Programming_and_Clock_FPGA (U1.H13), MIPI_Interface (J8.11)
CAM_SCL: Programming_and_Clock_FPGA (U1.J14), MIPI_Interface (J8.13 R15.1)
CAM_SDA: Programming_and_Clock_FPGA (U1.G13), MIPI_Interface (J8.14 R31.1)
DDR3_A0: Programming_and_Clock_FPGA (U1.AA8), RAM (R17.2 U4.N3)
DDR3_A1: Programming_and_Clock_FPGA (U1.U5), RAM (R23.2 U4.P7)
DDR3_A2: Programming_and_Clock_FPGA (U1.Y9), RAM (R18.2 U4.P3)
DDR3_A3: Programming_and_Clock_FPGA (U1.Y8), RAM (R19.2 U4.N2)
DDR3_A4: Programming_and_Clock_FPGA (U1.V5), RAM (R20.2 U4.P8)
DDR3_A5: Programming_and_Clock_FPGA (U1.W7), RAM (R24.2 U4.P2)
DDR3_A6: Programming_and_Clock_FPGA (U1.U6), RAM (R21.2 U4.R8)
DDR3_A7: Programming_and_Clock_FPGA (U1.V7), RAM (R25.2 U4.R2)
DDR3_A8: Programming_and_Clock_FPGA (U1.T5), RAM (R26.2 U4.T8)
DDR3_A9: Programming_and_Clock_FPGA (U1.W9), RAM (R22.2 U4.R3)
DDR3_A10: Programming_and_Clock_FPGA (U1.AA6), RAM (R27.2 U4.L7)
DDR3_A11: Programming_and_Clock_FPGA (U1.T6), RAM (R28.2 U4.R7)
DDR3_A12: Programming_and_Clock_FPGA (U1.Y6), RAM (R29.2 U4.N7)
DDR3_A13: Programming_and_Clock_FPGA (U1.R6), RAM (R30.2 U4.T3)
DDR3_BA0: Programming_and_Clock_FPGA (U1.AB8), RAM (R32.2 U4.M2)
DDR3_BA1: Programming_and_Clock_FPGA (U1.W5), RAM (R33.2 U4.N8)
DDR3_BA2: Programming_and_Clock_FPGA (U1.Y7), RAM (R34.2 U4.M3)
DDR3_CAS: Programming_and_Clock_FPGA (U1.T4), RAM (R38.2 U4.K3)
DDR3_CKE: Programming_and_Clock_FPGA (U1.R4), RAM (U4.K9)
DDR3_CLK0_N: Programming_and_Clock_FPGA (U1.V8), RAM (R35.2 U4.K7)
DDR3_CLK0_P: Programming_and_Clock_FPGA (U1.V9), RAM (R35.1 U4.J7)
DDR3_DQ0: Programming_and_Clock_FPGA (U1.V4), RAM (U4.E3)
DDR3_DQ1: Programming_and_Clock_FPGA (U1.AB2), RAM (U4.F7)
DDR3_DQ2: Programming_and_Clock_FPGA (U1.AB3), RAM (U4.F2)
DDR3_DQ3: Programming_and_Clock_FPGA (U1.AA1), RAM (U4.F8)
DDR3_DQ4: Programming_and_Clock_FPGA (U1.AA5), RAM (U4.H3)
DDR3_DQ5: Programming_and_Clock_FPGA (U1.Y4), RAM (U4.H8)
DDR3_DQ6: Programming_and_Clock_FPGA (U1.AB5), RAM (U4.G2)
DDR3_DQ7: Programming_and_Clock_FPGA (U1.AA4), RAM (U4.H7)
DDR3_DQ8: Programming_and_Clock_FPGA (U1.V2), RAM (U4.D7)
DDR3_DQ9: Programming_and_Clock_FPGA (U1.Y1), RAM (U4.C3)
DDR3_DQ10: Programming_and_Clock_FPGA (U1.U1), RAM (U4.C8)
DDR3_DQ11: Programming_and_Clock_FPGA (U1.Y2), RAM (U4.C2)
DDR3_DQ12: Programming_and_Clock_FPGA (U1.T1), RAM (U4.A7)
DDR3_DQ13: Programming_and_Clock_FPGA (U1.W1), RAM (U4.A2)
DDR3_DQ14: Programming_and_Clock_FPGA (U1.U2), RAM (U4.B8)
DDR3_DQ15: Programming_and_Clock_FPGA (U1.U3), RAM (U4.A3)
DDR3_LDM: Programming_and_Clock_FPGA (U1.AB1), RAM (U4.E7)
DDR3_LDQS_N: Programming_and_Clock_FPGA (U1.AA3), RAM (U4.G3)
DDR3_LDQS_P: Programming_and_Clock_FPGA (U1.Y3), RAM (U4.F3)
DDR3_ODT: Programming_and_Clock_FPGA (U1.AB6), RAM (U4.K1)
DDR3_RAS: Programming_and_Clock_FPGA (U1.AB7), RAM (R37.2 U4.J3)
DDR3_RESET_N: Programming_and_Clock_FPGA (U1.T3), RAM (R40.2 U4.T2)
DDR3_S0: Programming_and_Clock_FPGA (U1.U7), RAM (U4.L2)
DDR3_UDM: Programming_and_Clock_FPGA (U1.W2), RAM (U4.D3)
DDR3_UDQS_N: Programming_and_Clock_FPGA (U1.R2), RAM (U4.B7)
DDR3_UDQS_P: Programming_and_Clock_FPGA (U1.R3), RAM (U4.C7)
DDR3_WE: Programming_and_Clock_FPGA (U1.W6), RAM (R36.2 U4.L3)
HDMI1_CLK_N: Programming_and_Clock_FPGA (U1.D1), HDMI (J6.12 R115.2 U31.1 U31.10)
HDMI1_CLK_P: Programming_and_Clock_FPGA (U1.E1), HDMI (J6.10 R116.2 U31.2 U31.9)
HDMI1_D0_N: Programming_and_Clock_FPGA (U1.F1), HDMI (J6.9 R117.2 U31.4 U31.7)
HDMI1_D0_P: Programming_and_Clock_FPGA (U1.G1), HDMI (J6.7 R118.2 U31.5 U31.6)
HDMI1_D1_N: Programming_and_Clock_FPGA (U1.G2), HDMI (J6.6 R111.2 U30.1 U30.10)
HDMI1_D1_P: Programming_and_Clock_FPGA (U1.H2), HDMI (J6.4 R112.2 U30.2 U30.9)
HDMI1_D2_N: Programming_and_Clock_FPGA (U1.J1), HDMI (J6.3 R113.2 U30.4 U30.7)
HDMI1_D2_P: Programming_and_Clock_FPGA (U1.K1), HDMI (J6.1 R114.2 U30.5 U30.6)
HDMI1_HPD: Programming_and_Clock_FPGA (U1.P5), HDMI (R119.2 R122.1 U15.2)
HDMI1_OUT_EN: Programming_and_Clock_FPGA (U1.M6), HDMI (U15.1)
HDMI1_SCL: Programming_and_Clock_FPGA (U1.P4), HDMI (J6.15)
HDMI1_SDA: Programming_and_Clock_FPGA (U1.N3), HDMI (J6.16)
KEY1: Programming_and_Clock_FPGA (U1.M13), LEDS_And_Buttons (R63.2)
KEY2: Programming_and_Clock_FPGA (U1.K14), LEDS_And_Buttons (R64.2)
KEY3: Programming_and_Clock_FPGA (U1.K13), LEDS_And_Buttons (R65.2)
KEY4: Programming_and_Clock_FPGA (U1.L13), LEDS_And_Buttons (R62.2)
LED1: Programming_and_Clock_FPGA (U1.F19), LEDS_And_Buttons (R54.2)
LED2: Programming_and_Clock_FPGA (U1.E21), LEDS_And_Buttons (R55.2)
LED3: Programming_and_Clock_FPGA (U1.D20), LEDS_And_Buttons (R56.2)
LED4: Programming_and_Clock_FPGA (U1.C20), LEDS_And_Buttons (R57.2)
LP_CLK_N: Programming_and_Clock_FPGA (U1.A1), MIPI_Interface (R12.2)
LP_CLK_P: Programming_and_Clock_FPGA (U1.B1), MIPI_Interface (R14.2)
LP_LANE0_N: Programming_and_Clock_FPGA (U1.B2), MIPI_Interface (R7.2)
LP_LANE0_P: Programming_and_Clock_FPGA (U1.C2), MIPI_Interface (R8.2)
LP_LANE1_N: Programming_and_Clock_FPGA (U1.J2), MIPI_Interface (R11.2)
LP_LANE1_P: Programming_and_Clock_FPGA (U1.K2), MIPI_Interface (R13.2)
MIPI_CLK_N: Programming_and_Clock_FPGA (U1.G3), MIPI_Interface (J8.8 R10.2 R12.1)
MIPI_CLK_P: Programming_and_Clock_FPGA (U1.H3), MIPI_Interface (J8.9 R10.1 R14.1)
MIPI_LAN0_N: Programming_and_Clock_FPGA (U1.D2), MIPI_Interface (J8.2 R6.1 R7.1)
MIPI_LAN0_P: Programming_and_Clock_FPGA (U1.E2), MIPI_Interface (J8.3 R6.2 R8.1)
MIPI_LAN1_N: Programming_and_Clock_FPGA (U1.E3), MIPI_Interface (J8.5 R9.2 R11.1)
MIPI_LAN1_P: Programming_and_Clock_FPGA (U1.F3), MIPI_Interface (J8.6 R9.1 R13.1)